# EasyEDA Pro project ProProject_Electonic_keyboard_2023-12-26.epro

# Schematic Electonic Keyboard
Create Date: 2023-12-26; Page Name: P1.Electonic Keyboard; Project Name: Electonic_keyboard; Schematic Name: Electonic Keyboard; Update Date: 2023-12-26; Company: 嘉立创EDA; Drawed: Cameron Bright; Page Size: A4; Reviewed: Cameron Bright; Version: V1.0
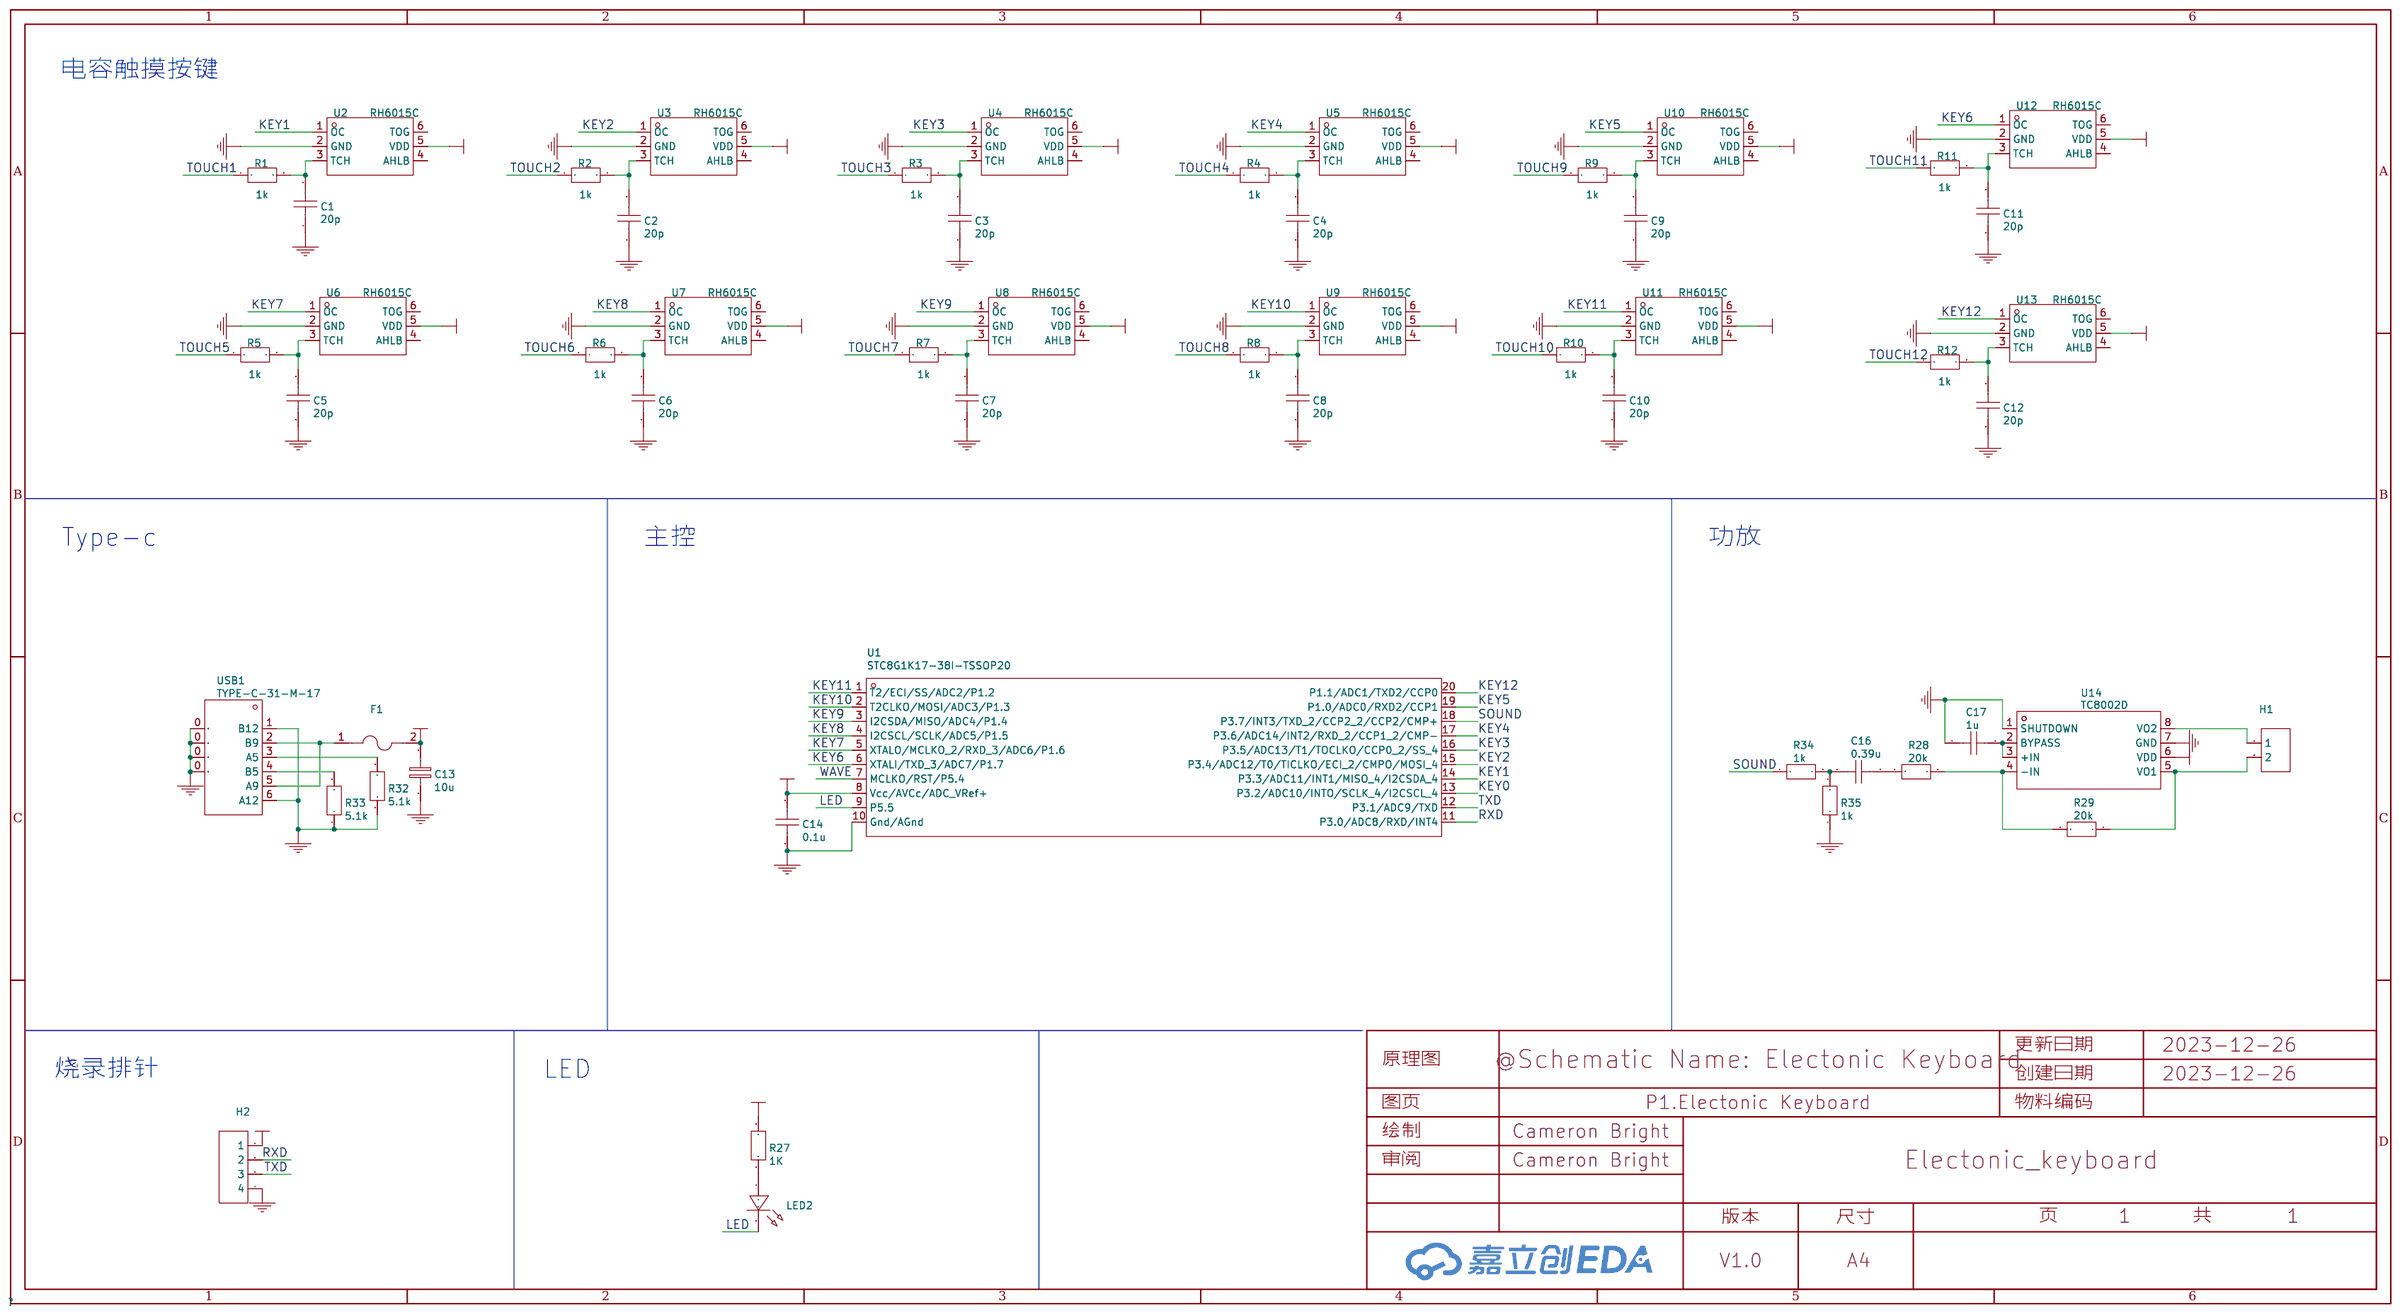
[diagram p0: schematic sheet]

## Parts
C1  20p
C2  20p
C3  20p
C4  20p
C5  20p
C6  20p
C7  20p
C8  20p
C9  20p
C10  20p
C11  20p
C12  20p
C13  10u
C14  0.1u
C16  0.39u
C17  1u
F1  ASMD0805-050
H1  HDR-F-2.54_1x2
H2  HDR-F-2.54_1x4
LED2  LED-0805_R
R1  1k
R2  1k
R3  1k
R4  1k
R5  1k
R6  1k
R7  1k
R8  1k
R9  1k
R10  1k
R11  1k
R12  1k
R27  1K
R28  20k
R29  20k
R32  5.1k
R33  5.1k
R34  1k
R35  1k
U1  STC8G1K17-38I-TSSOP20
U2  RH6015C
U3  RH6015C
U4  RH6015C
U5  RH6015C
U6  RH6015C
U7  RH6015C
U8  RH6015C
U9  RH6015C
U10  RH6015C
U11  RH6015C
U12  RH6015C
U13  RH6015C
U14  TC8002D
USB1  TYPE-C-31-M-17

## Library data of the parts
C1-C12 = 20p
C13 = 10u
C14 = 0.1u
C16 = 0.39u
C17 = 1u
F1 = ASMD0805-050: Supplier: LCSC; Manufacturer: JDTFUSE; Supplier Part: C135329; JLCPCB Part Class: Extended Part
H1 = HDR-F-2.54_1x2: Supplier Part: C49661; Supplier: LCSC
H2 = HDR-F-2.54_1x4: Supplier Part: C225501; Supplier: LCSC
LED2 = LED-0805_R: Manufacturer: EVERLIGHT(台湾亿光); Manufacturer Part: 17-21SURC/S530-A3/TR8; Supplier Part: C72037
R1-R12 R34 R35 = 1k
R27 = 1K
R28 R29 = 20k
R32 R33 = 5.1k
U1 = STC8G1K17-38I-TSSOP20: Supplier: LCSC; Supplier Part: C521759; Manufacturer: STC Micro; JLCPCB Part Class: Extended Part
U2-U13 = RH6015C: Supplier: LCSC; Supplier Part: C161821; Manufacturer: RONGHE Microelectronics; JLCPCB Part Class: Extend
U14 = TC8002D: Supplier: LCSC; Manufacturer: FM(富满); Supplier Part: C87265; JLCPCB Part Class: Extended Part
USB1 = TYPE-C-31-M-17: Supplier: LCSC; Supplier Part: C283540; Manufacturer: Korean Hroparts Elec; JLCPCB Part Class: Extended Part

## Nets
GND: C1.1 C2.1 C3.1 C4.1 C5.1 C6.1 C7.1 C8.1 C9.1 C10.1 C11.1 C12.1 C13.1 C14.1 C17.2 H2.4 R32.1 R33.1 R35.1 U1.10(Gnd/AGnd) U2.2(GND) U3.2(GND) U4.2(GND) U5.2(GND) U6.2(GND) U7.2(GND) U8.2(GND) U9.2(GND) U10.2(GND) U11.2(GND) U12.2(GND) U13.2(GND) U14.1(SHUTDOWN) U14.7(GND) USB1.0 USB1.1(B12) USB1.6(A12)
VCC: C13.2 C14.2 F1.2 H2.1 R27.2 U1.8(Vcc/AVCc/ADC_VRef+) U2.5(VDD) U3.5(VDD) U4.5(VDD) U5.5(VDD) U6.5(VDD) U7.5(VDD) U8.5(VDD) U9.5(VDD) U10.5(VDD) U11.5(VDD) U12.5(VDD) U13.5(VDD) U14.6(VDD)
KEY0: U1.13(P3.2/ADC10/INTO/SCLK_4/I2CSCL_4)
KEY1: U1.14(P3.3/ADC11/INT1/MISO_4/I2CSDA_4) U2.1(OC)
KEY2: U1.15(P3.4/ADC12/T0/TICLKO/ECI_2/CMPO/MOSI_4) U3.1(OC)
KEY3: U1.16(P3.5/ADC13/T1/TOCLKO/CCP0_2/SS_4) U4.1(OC)
KEY4: U1.17(P3.6/ADC14/INT2/RXD_2/CCP1_2/CMP-) U5.1(OC)
KEY5: U1.19(P1.0/ADC0/RXD2/CCP1) U10.1(OC)
KEY6: U1.6(XTALI/TXD_3/ADC7/P1.7) U12.1(OC)
KEY7: U1.5(XTALO/MCLKO_2/RXD_3/ADC6/P1.6) U6.1(OC)
KEY8: U1.4(I2CSCL/SCLK/ADC5/P1.5) U7.1(OC)
KEY9: U1.3(I2CSDA/MISO/ADC4/P1.4) U8.1(OC)
KEY10: U1.2(T2CLKO/MOSI/ADC3/P1.3) U9.1(OC)
KEY11: U1.1(T2/ECI/SS/ADC2/P1.2) U11.1(OC)
KEY12: U1.20(P1.1/ADC1/TXD2/CCP0) U13.1(OC)
LED: LED2.2 U1.9(P5.5)
RXD: H2.2 U1.11(P3.0/ADC8/RXD/INT4)
SOUND: R34.1 U1.18(P3.7/INT3/TXD_2/CCP2_2/CCP2/CMP+)
TOUCH1: R1.1
TOUCH2: R2.1
TOUCH3: R3.1
TOUCH4: R4.1
TOUCH5: R5.1
TOUCH6: R6.1
TOUCH7: R7.1
TOUCH8: R8.1
TOUCH9: R9.1
TOUCH10: R10.1
TOUCH11: R11.1
TOUCH12: R12.1
TXD: H2.3 U1.12(P3.1/ADC9/TXD)
WAVE: U1.7(MCLKO/RST/P5.4)
Net-(C1-2): C1.2 R1.2 U2.3(TCH)
Net-(C2-2): C2.2 R2.2 U3.3(TCH)
Net-(C3-2): C3.2 R3.2 U4.3(TCH)
Net-(C4-2): C4.2 R4.2 U5.3(TCH)
Net-(C5-2): C5.2 R5.2 U6.3(TCH)
Net-(C6-2): C6.2 R6.2 U7.3(TCH)
Net-(C7-2): C7.2 R7.2 U8.3(TCH)
Net-(C8-2): C8.2 R8.2 U9.3(TCH)
Net-(C9-2): C9.2 R9.2 U10.3(TCH)
Net-(C10-2): C10.2 R10.2 U11.3(TCH)
Net-(C11-2): C11.2 R11.2 U12.3(TCH)
Net-(C12-2): C12.2 R12.2 U13.3(TCH)
Net-(C16-1): C16.1 R34.2 R35.2
Net-(C16-2): C16.2 R28.2
Net-(C17-1): C17.1 U14.2(BYPASS) U14.3(+IN)
Net-(F1-1): F1.1 USB1.2(B9) USB1.5(A9)
Net-(H1-1): H1.1 U14.8(VO2)
Net-(H1-2): H1.2 R29.1 U14.5(VO1)
Net-(LED2-1): LED2.1 R27.1
Net-(R28-1): R28.1 R29.2 U14.4(-IN)
Net-(R32-2): R32.2 USB1.3(A5)
Net-(R33-2): R33.2 USB1.4(B5)

Not connected (* = marked no-connect by the designer): U2 4(AHLB) 6(TOG); U3 4(AHLB) 6(TOG); U4 4(AHLB) 6(TOG); U5 4(AHLB) 6(TOG); U6 4(AHLB) 6(TOG); U7 4(AHLB) 6(TOG); U8 4(AHLB) 6(TOG); U9 4(AHLB) 6(TOG); U10 4(AHLB) 6(TOG); U11 4(AHLB) 6(TOG); U12 4(AHLB) 6(TOG); U13 4(AHLB) 6(TOG)

## Notes on the sheet
- 电容触摸按键
- Type-c
- 主控
- 功放
- 烧录排针
- LED

# Schematic 迷你电子琴
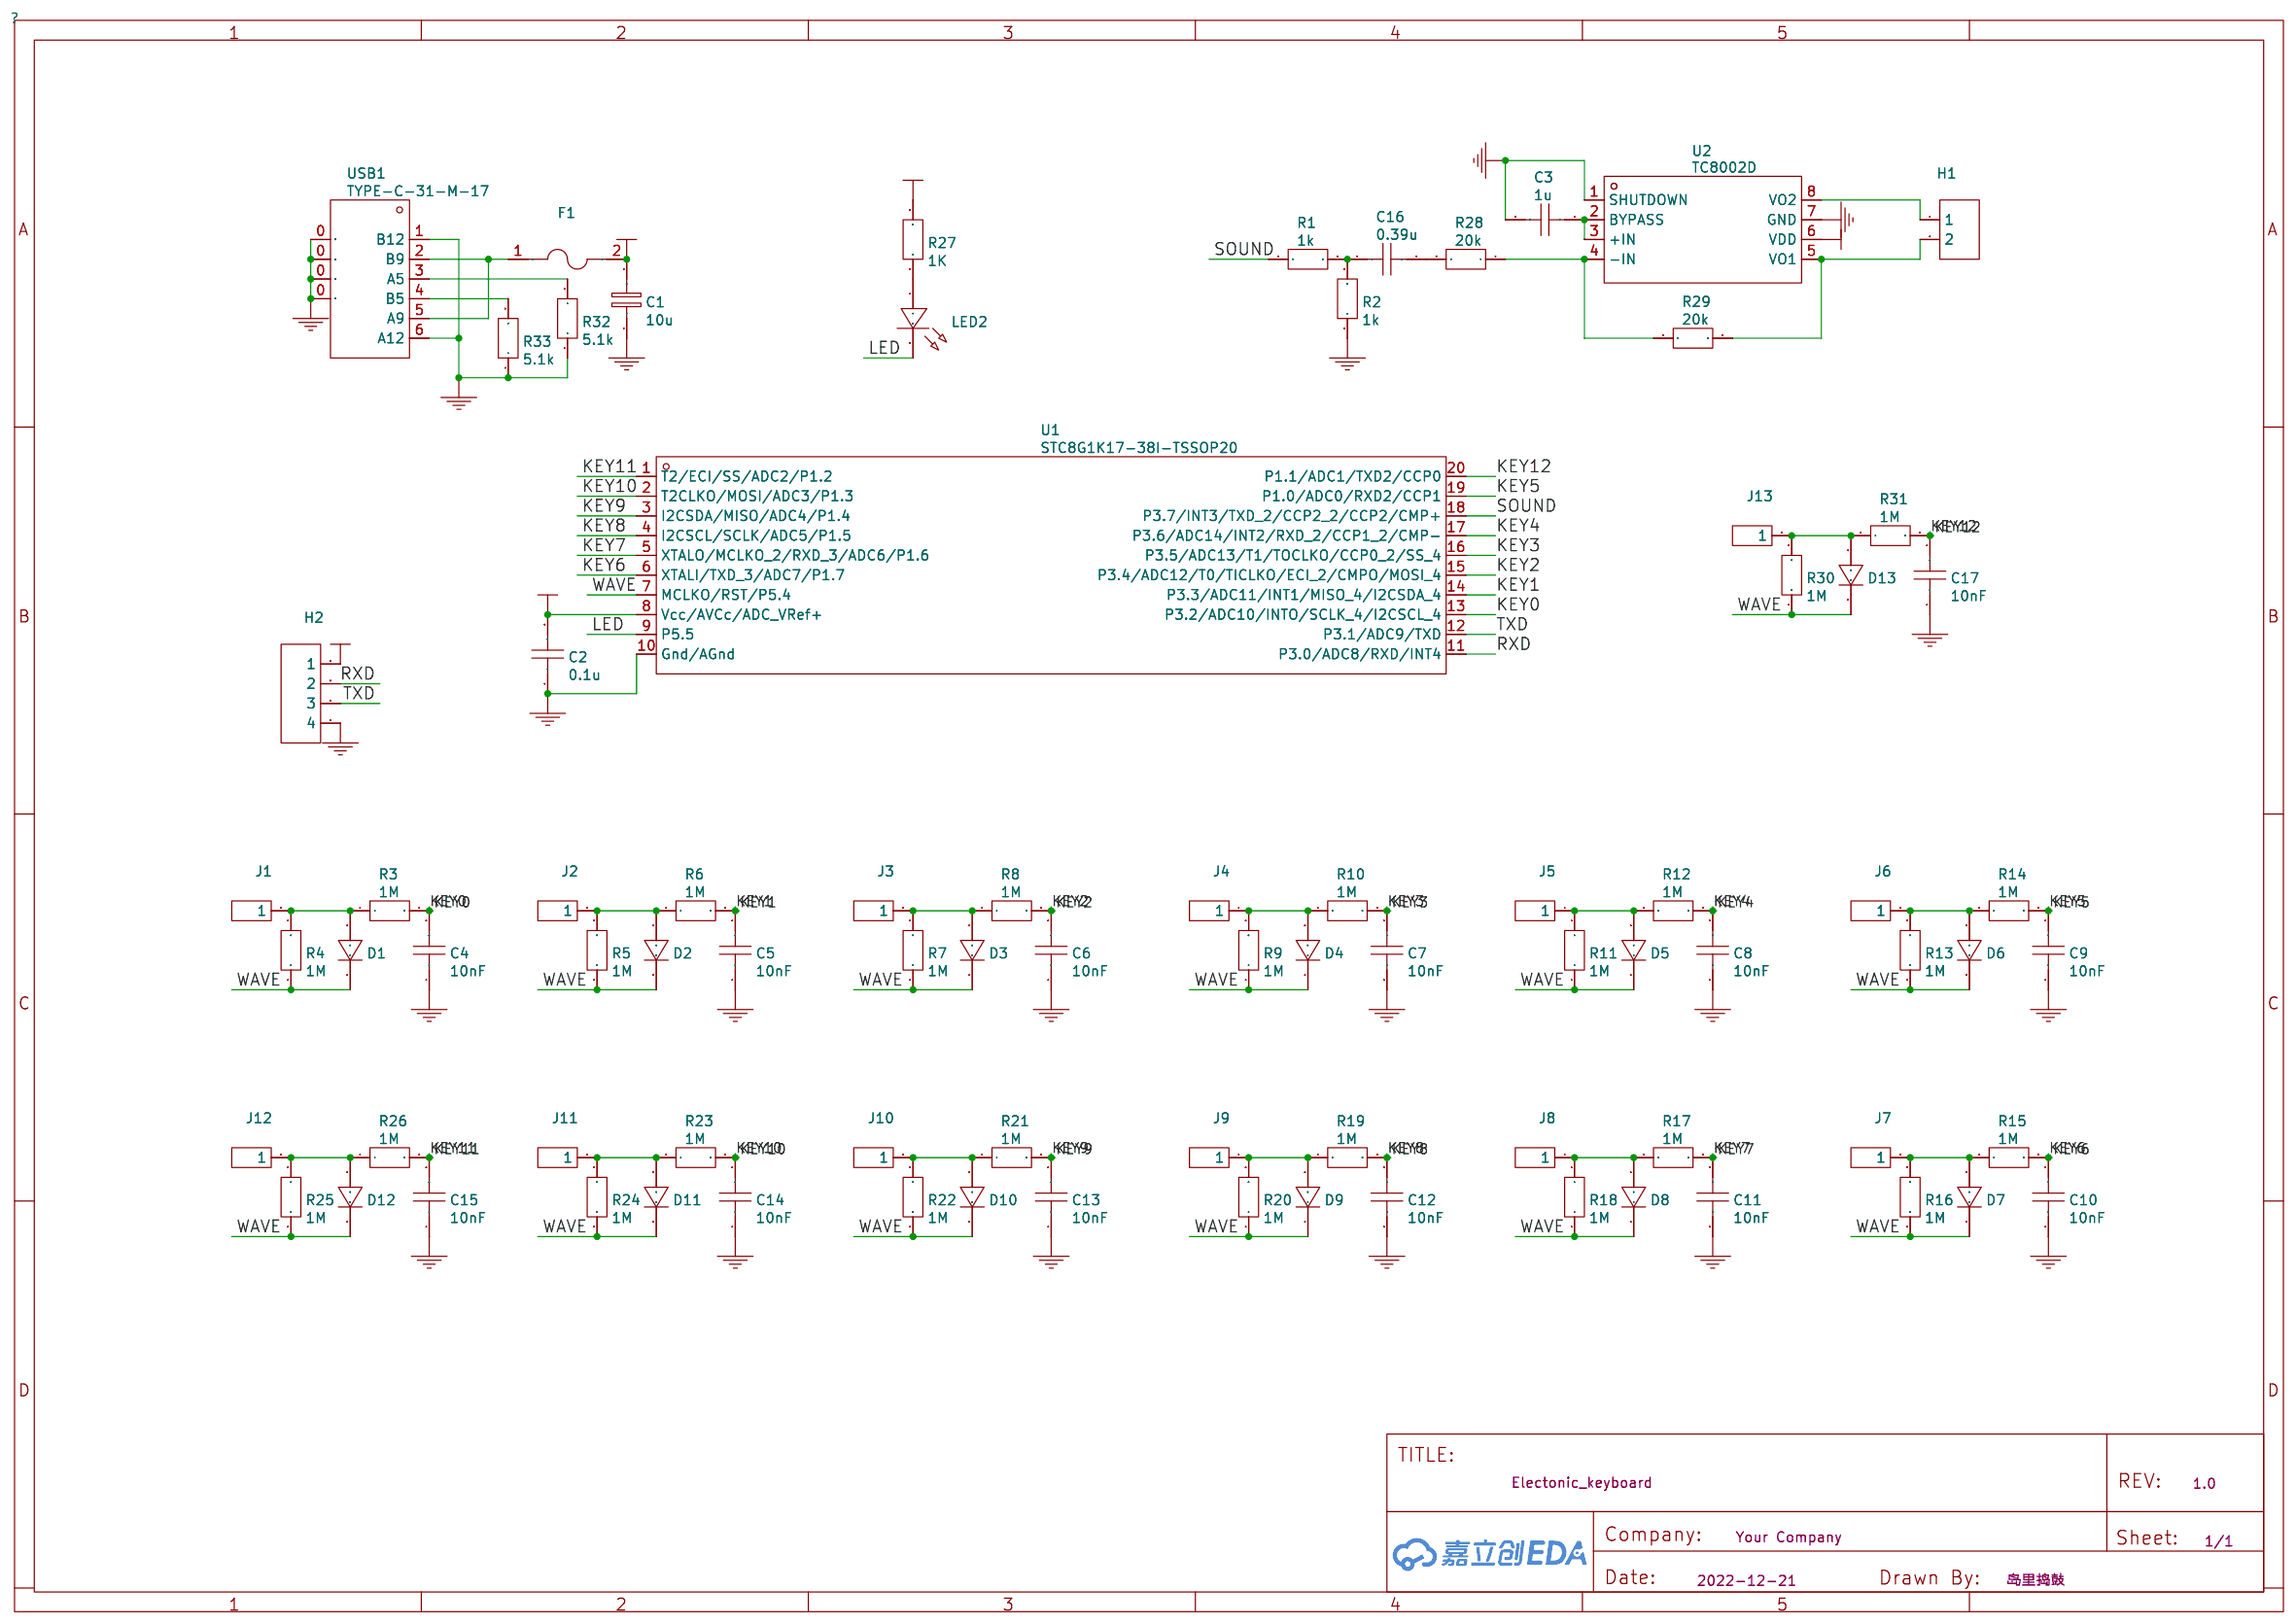
[diagram p1: schematic sheet]

## Parts
C1  10u
C2  0.1u
C3  1u
C4  10nF
C5  10nF
C6  10nF
C7  10nF
C8  10nF
C9  10nF
C10  10nF
C11  10nF
C12  10nF
C13  10nF
C14  10nF
C15  10nF
C16  0.39u
C17  10nF
D1  1N4148W
D2  1N4148W
D3  1N4148W
D4  1N4148W
D5  1N4148W
D6  1N4148W
D7  1N4148W
D8  1N4148W
D9  1N4148W
D10  1N4148W
D11  1N4148W
D12  1N4148W
D13  1N4148W
F1  ASMD0805-050
H1  HDR-F-2.54_1x2
H2  HDR-F-2.54_1x4
J1  HDR-M-2.54_1x1
J2  HDR-M-2.54_1x1
J3  HDR-M-2.54_1x1
J4  HDR-M-2.54_1x1
J5  HDR-M-2.54_1x1
J6  HDR-M-2.54_1x1
J7  HDR-M-2.54_1x1
J8  HDR-M-2.54_1x1
J9  HDR-M-2.54_1x1
J10  HDR-M-2.54_1x1
J11  HDR-M-2.54_1x1
J12  HDR-M-2.54_1x1
J13  HDR-M-2.54_1x1
LED2  LED-0805_R
R1  1k
R2  1k
R3  1M
R4  1M
R5  1M
R6  1M
R7  1M
R8  1M
R9  1M
R10  1M
R11  1M
R12  1M
R13  1M
R14  1M
R15  1M
R16  1M
R17  1M
R18  1M
R19  1M
R20  1M
R21  1M
R22  1M
R23  1M
R24  1M
R25  1M
R26  1M
R27  1K
R28  20k
R29  20k
R30  1M
R31  1M
R32  5.1k
R33  5.1k
U1  STC8G1K17-38I-TSSOP20
U2  TC8002D
USB1  TYPE-C-31-M-17

## Library data of the parts
C1 = 10u
C2 = 0.1u
C3 = 1u
C4-C15 C17 = 10nF
C16 = 0.39u
D1-D13 = 1N4148W: Supplier: LCSC; Manufacturer: Tak Cheong; Supplier Part: C129216
F1 = ASMD0805-050: Supplier: LCSC; Manufacturer: JDTFUSE; Supplier Part: C135329; JLCPCB Part Class: Extended Part
H1 = HDR-F-2.54_1x2: Supplier Part: C49661; Supplier: LCSC
H2 = HDR-F-2.54_1x4: Supplier Part: C225501; Supplier: LCSC
J1-J13 = HDR-M-2.54_1x1: Supplier Part: C81276; Supplier: LCSC
LED2 = LED-0805_R: Manufacturer: EVERLIGHT(台湾亿光); Manufacturer Part: 17-21SURC/S530-A3/TR8; Supplier Part: C72037
R1 R2 = 1k
R3-R26 R30 R31 = 1M
R27 = 1K
R28 R29 = 20k
R32 R33 = 5.1k
U1 = STC8G1K17-38I-TSSOP20: Supplier: LCSC; Supplier Part: C521759; Manufacturer: STC Micro; JLCPCB Part Class: Extended Part
U2 = TC8002D: Supplier: LCSC; Manufacturer: FM(富满); Supplier Part: C87265; JLCPCB Part Class: Extended Part
USB1 = TYPE-C-31-M-17: Supplier: LCSC; Supplier Part: C283540; Manufacturer: Korean Hroparts Elec; JLCPCB Part Class: Extended Part

## Nets
GND: C1.1 C2.1 C3.2 C4.1 C5.1 C6.1 C7.1 C8.1 C9.1 C10.1 C11.1 C12.1 C13.1 C14.1 C15.1 C17.1 H2.4 R2.1 R32.1 R33.1 U1.10(Gnd/AGnd) U2.1(SHUTDOWN) U2.7(GND) USB1.0 USB1.1(B12) USB1.6(A12)
VCC: C1.2 C2.2 F1.2 H2.1 R27.2 U1.8(Vcc/AVCc/ADC_VRef+) U2.6(VDD)
KEY0: C4.2 R3.2 U1.13(P3.2/ADC10/INTO/SCLK_4/I2CSCL_4)
KEY1: C5.2 R6.2 U1.14(P3.3/ADC11/INT1/MISO_4/I2CSDA_4)
KEY2: C6.2 R8.2 U1.15(P3.4/ADC12/T0/TICLKO/ECI_2/CMPO/MOSI_4)
KEY3: C7.2 R10.2 U1.16(P3.5/ADC13/T1/TOCLKO/CCP0_2/SS_4)
KEY4: C8.2 R12.2 U1.17(P3.6/ADC14/INT2/RXD_2/CCP1_2/CMP-)
KEY5: C9.2 R14.2 U1.19(P1.0/ADC0/RXD2/CCP1)
KEY6: C10.2 R15.2 U1.6(XTALI/TXD_3/ADC7/P1.7)
KEY7: C11.2 R17.2 U1.5(XTALO/MCLKO_2/RXD_3/ADC6/P1.6)
KEY8: C12.2 R19.2 U1.4(I2CSCL/SCLK/ADC5/P1.5)
KEY9: C13.2 R21.2 U1.3(I2CSDA/MISO/ADC4/P1.4)
KEY10: C14.2 R23.2 U1.2(T2CLKO/MOSI/ADC3/P1.3)
KEY11: C15.2 R26.2 U1.1(T2/ECI/SS/ADC2/P1.2)
KEY12: C17.2 R31.2 U1.20(P1.1/ADC1/TXD2/CCP0)
LED: LED2.2 U1.9(P5.5)
RXD: H2.2 U1.11(P3.0/ADC8/RXD/INT4)
SOUND: R1.1 U1.18(P3.7/INT3/TXD_2/CCP2_2/CCP2/CMP+)
TXD: H2.3 U1.12(P3.1/ADC9/TXD)
WAVE: D1.1 D2.1 D3.1 D4.1 D5.1 D6.1 D7.1 D8.1 D9.1 D10.1 D11.1 D12.1 D13.1 R4.1 R5.1 R7.1 R9.1 R11.1 R13.1 R16.1 R18.1 R20.1 R22.1 R24.1 R25.1 R30.1 U1.7(MCLKO/RST/P5.4)
Net-(C3-1): C3.1 U2.2(BYPASS) U2.3(+IN)
Net-(C16-1): C16.1 R1.2 R2.2
Net-(C16-2): C16.2 R28.2
Net-(D1-2): D1.2 J1.1 R3.1 R4.2
Net-(D2-2): D2.2 J2.1 R5.2 R6.1
Net-(D3-2): D3.2 J3.1 R7.2 R8.1
Net-(D4-2): D4.2 J4.1 R9.2 R10.1
Net-(D5-2): D5.2 J5.1 R11.2 R12.1
Net-(D6-2): D6.2 J6.1 R13.2 R14.1
Net-(D7-2): D7.2 J7.1 R15.1 R16.2
Net-(D8-2): D8.2 J8.1 R17.1 R18.2
Net-(D9-2): D9.2 J9.1 R19.1 R20.2
Net-(D10-2): D10.2 J10.1 R21.1 R22.2
Net-(D11-2): D11.2 J11.1 R23.1 R24.2
Net-(D12-2): D12.2 J12.1 R25.2 R26.1
Net-(D13-2): D13.2 J13.1 R30.2 R31.1
Net-(F1-1): F1.1 USB1.2(B9) USB1.5(A9)
Net-(H1-1): H1.1 U2.8(VO2)
Net-(H1-2): H1.2 R29.1 U2.5(VO1)
Net-(LED2-1): LED2.1 R27.1
Net-(R28-1): R28.1 R29.2 U2.4(-IN)
Net-(R32-2): R32.2 USB1.3(A5)
Net-(R33-2): R33.2 USB1.4(B5)

# Schematic Mini_Piano
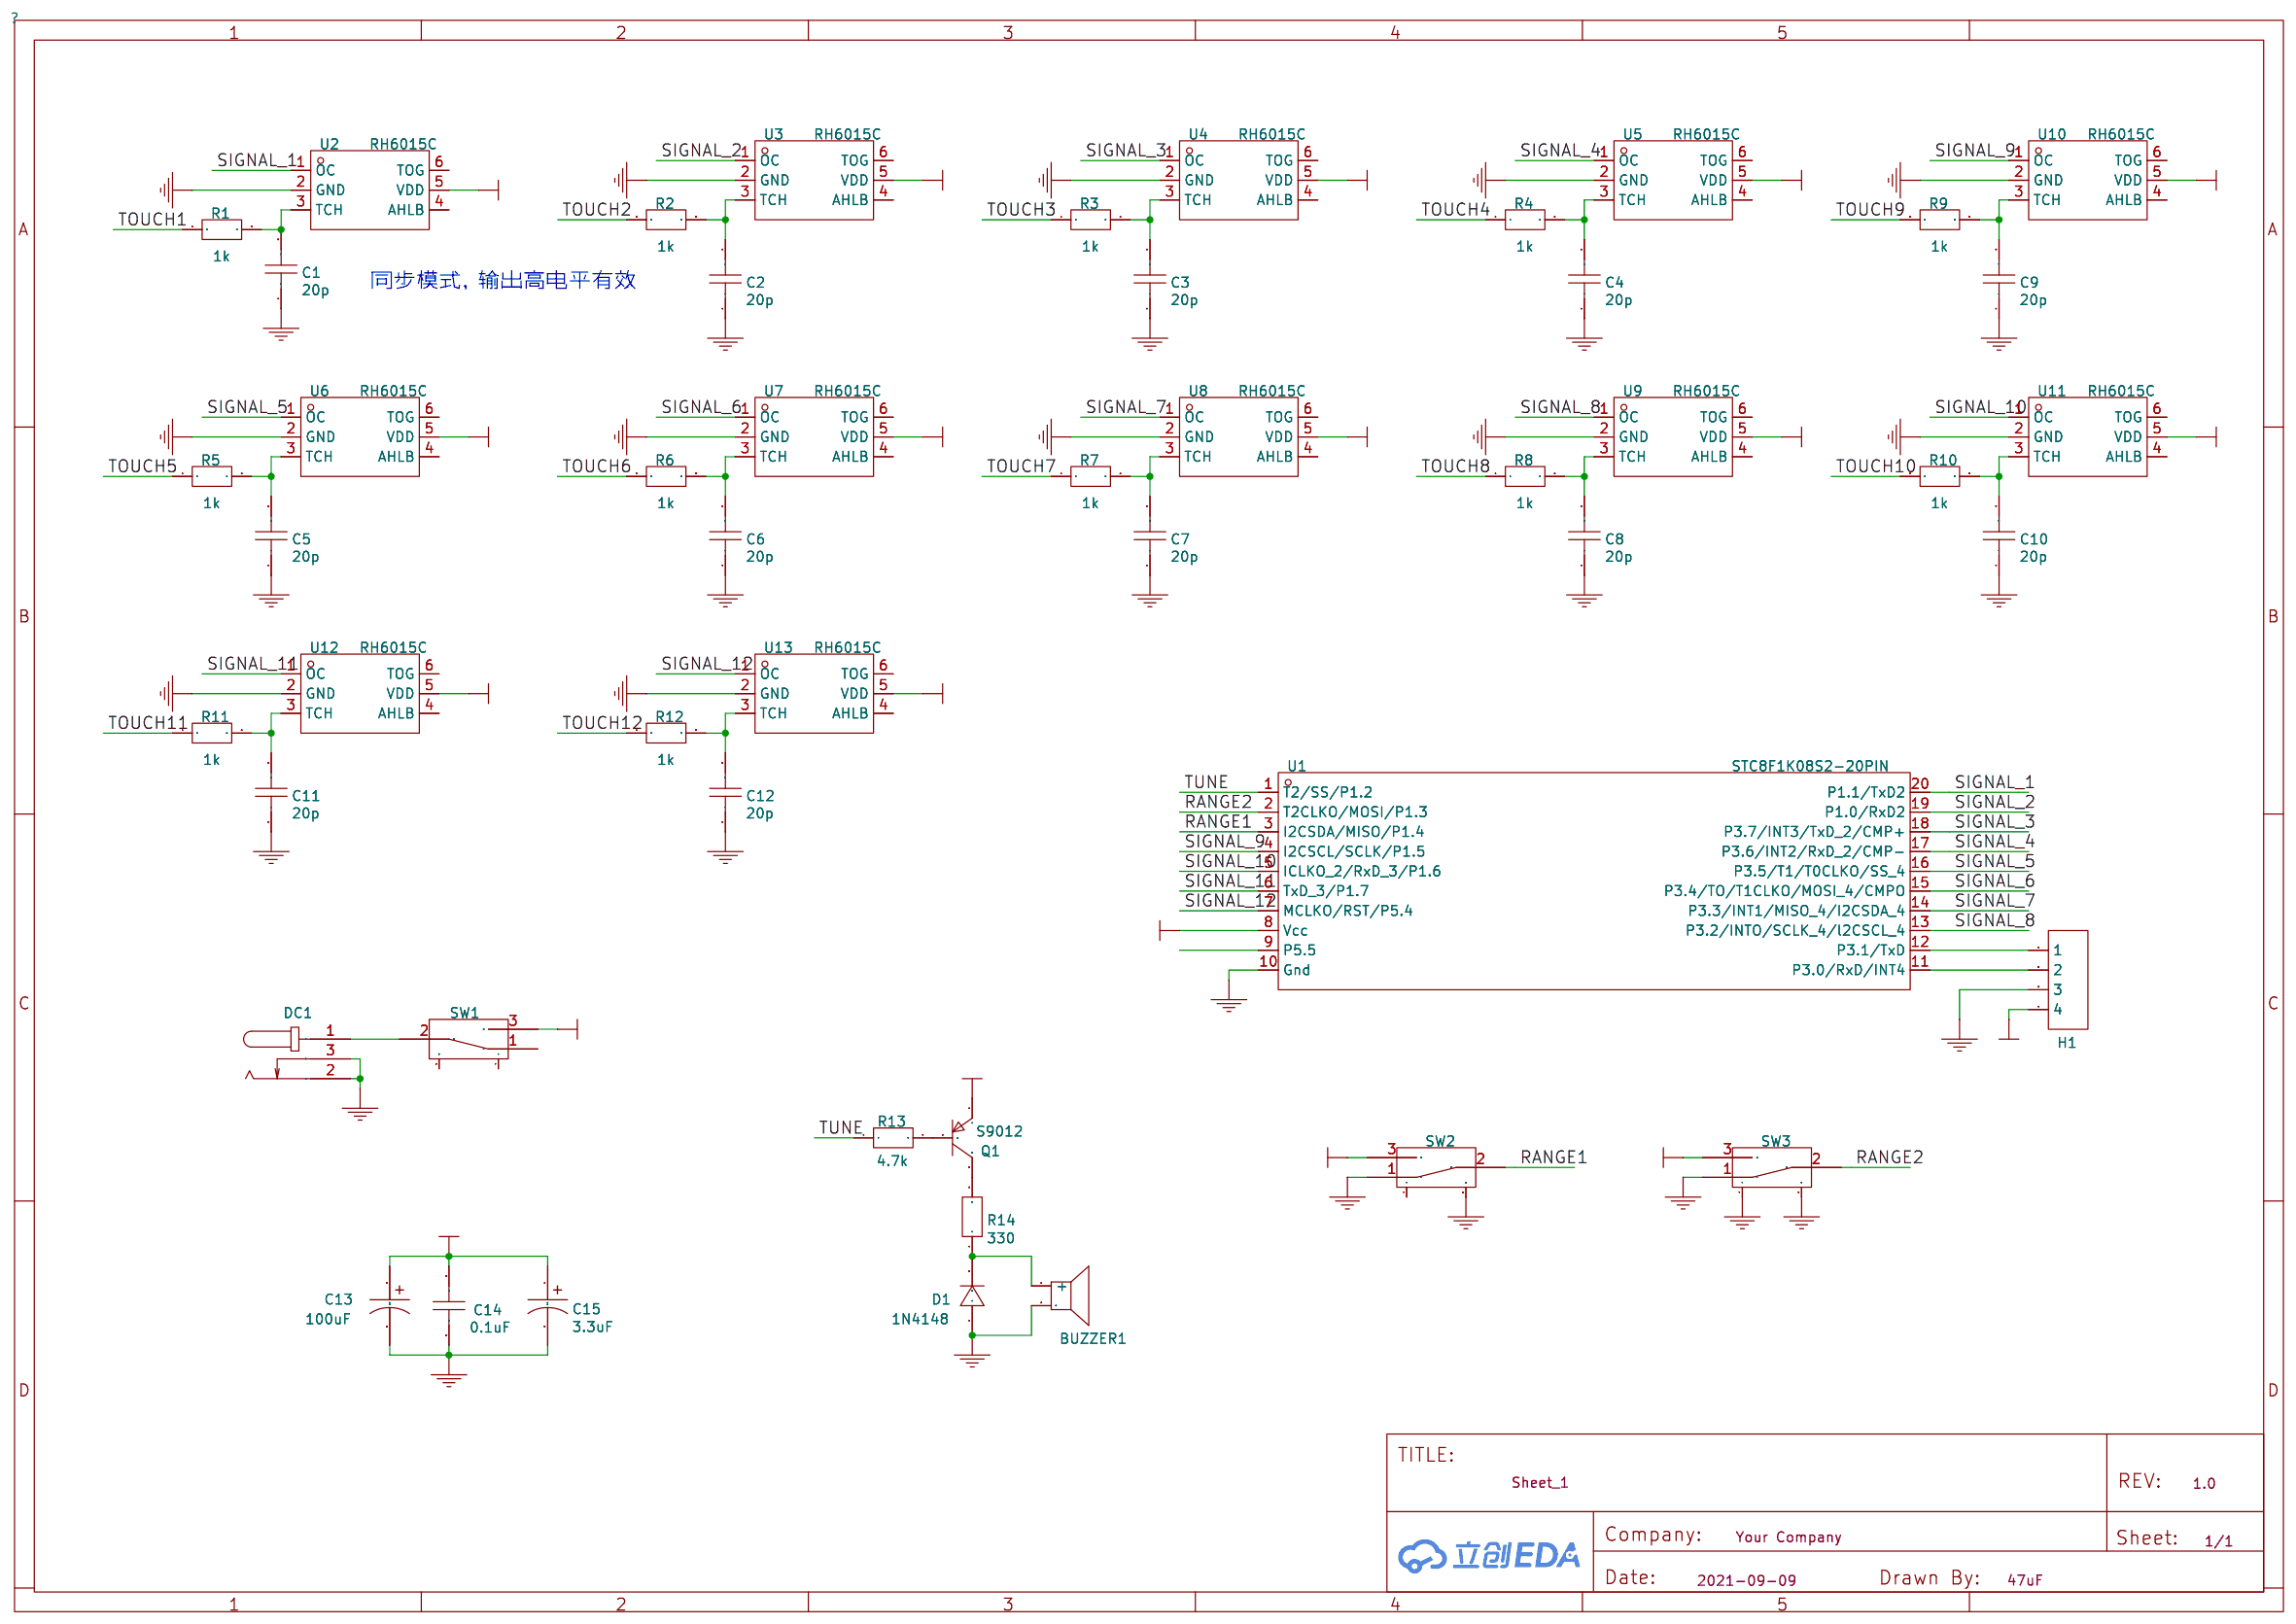
[diagram p2: schematic sheet]

## Parts
BUZZER1  SUN-12095-5VPA7.6
C1  20p
C2  20p
C3  20p
C4  20p
C5  20p
C6  20p
C7  20p
C8  20p
C9  20p
C10  20p
C11  20p
C12  20p
C13  100uF
C14  0.1uF
C15  3.3uF
D1  1N4148
DC1  DC005-T
H1  HDR-F-2.54_1x4
Q1  S9012
R1  1k
R2  1k
R3  1k
R4  1k
R5  1k
R6  1k
R7  1k
R8  1k
R9  1k
R10  1k
R11  1k
R12  1k
R13  4.7k
R14  330
SW1  SK-12D02-VG5
SW2  SK-12D02-VG5
SW3  SK-12D02-VG5
U1  STC8F1K08S2-20PIN
U2  RH6015C
U3  RH6015C
U4  RH6015C
U5  RH6015C
U6  RH6015C
U7  RH6015C
U8  RH6015C
U9  RH6015C
U10  RH6015C
U11  RH6015C
U12  RH6015C
U13  RH6015C

## Library data of the parts
BUZZER1 = SUN-12095-5VPA7.6: Supplier: LCSC; Supplier Part: C360615; Manufacturer: S&amp;S; JLCPCB Part Class: Extended Part
C1-C12 = 20p
C13 = 100uF
C14 = 0.1uF
C15 = 3.3uF
D1 = 1N4148: Supplier: LCSC; Manufacturer: SEMTECH; Supplier Part: C14516
DC1 = DC005-T: Supplier: LCSC; Supplier Part: C431532; Manufacturer: SHOU HAN; JLCPCB Part Class: Extended Part
H1 = HDR-F-2.54_1x4: Supplier Part: C225501; Supplier: LCSC
Q1 = S9012: Supplier: LCSC; Manufacturer: KEC; Manufacturer Part: 2N3906S-RTK/PS; Supplier Part: C147294
R1-R12 = 1k
R13 = 4.7k
R14 = 330
SW1-SW3 = SK-12D02-VG5: Supplier: LCSC; Supplier Part: C136722; Manufacturer: Rectangular Connectors - Contacts
U1 = STC8F1K08S2-20PIN: Supplier: LCSC; Supplier Part: C2835636; Manufacturer: null; Manufacturer Part: STC8F1K08S2-20pin; JLCPCB Part Class: Extended Part
U2-U13 = RH6015C: Supplier: LCSC; Supplier Part: C161821; Manufacturer: RONGHE Microelectronics; JLCPCB Part Class: Extend

## Nets
GND: BUZZER1.2 C1.1 C2.1 C3.1 C4.1 C5.1 C6.1 C7.1 C8.1 C9.1 C10.1 C11.1 C12.1 C13.2 C14.1 C15.2 D1.1 DC1.2 DC1.3 H1.3 SW2.1 SW2.5 SW3.1 SW3.4 SW3.5 U1.10(Gnd) U2.2(GND) U3.2(GND) U4.2(GND) U5.2(GND) U6.2(GND) U7.2(GND) U8.2(GND) U9.2(GND) U10.2(GND) U11.2(GND) U12.2(GND) U13.2(GND)
VCC: C13.1 C14.2 C15.1 H1.4 Q1.1(E) SW1.3 SW2.3 SW3.3 U1.8(Vcc) U2.5(VDD) U3.5(VDD) U4.5(VDD) U5.5(VDD) U6.5(VDD) U7.5(VDD) U8.5(VDD) U9.5(VDD) U10.5(VDD) U11.5(VDD) U12.5(VDD) U13.5(VDD)
RANGE1: SW2.2 U1.3(I2CSDA/MISO/P1.4)
RANGE2: SW3.2 U1.2(T2CLKO/MOSI/P1.3)
SIGNAL_1: U1.20(P1.1/TxD2) U2.1(OC)
SIGNAL_2: U1.19(P1.0/RxD2) U3.1(OC)
SIGNAL_3: U1.18(P3.7/INT3/TxD_2/CMP+) U4.1(OC)
SIGNAL_4: U1.17(P3.6/INT2/RxD_2/CMP-) U5.1(OC)
SIGNAL_5: U1.16(P3.5/T1/T0CLKO/SS_4) U6.1(OC)
SIGNAL_6: U1.15(P3.4/TO/T1CLKO/MOSI_4/CMPO) U7.1(OC)
SIGNAL_7: U1.14(P3.3/INT1/MISO_4/I2CSDA_4) U8.1(OC)
SIGNAL_8: U1.13(P3.2/INTO/SCLK_4/l2CSCL_4) U9.1(OC)
SIGNAL_9: U1.4(I2CSCL/SCLK/P1.5) U10.1(OC)
SIGNAL_10: U1.5(ICLKO_2/RxD_3/P1.6) U11.1(OC)
SIGNAL_11: U1.6(TxD_3/P1.7) U12.1(OC)
SIGNAL_12: U1.7(MCLKO/RST/P5.4) U13.1(OC)
TOUCH1: R1.1
TOUCH2: R2.1
TOUCH3: R3.1
TOUCH4: R4.1
TOUCH5: R5.1
TOUCH6: R6.1
TOUCH7: R7.1
TOUCH8: R8.1
TOUCH9: R9.1
TOUCH10: R10.1
TOUCH11: R11.1
TOUCH12: R12.1
TUNE: R13.1 U1.1(T2/SS/P1.2)
Net-(BUZZER1-1): BUZZER1.1(+) D1.2 R14.1
Net-(C1-2): C1.2 R1.2 U2.3(TCH)
Net-(C2-2): C2.2 R2.2 U3.3(TCH)
Net-(C3-2): C3.2 R3.2 U4.3(TCH)
Net-(C4-2): C4.2 R4.2 U5.3(TCH)
Net-(C5-2): C5.2 R5.2 U6.3(TCH)
Net-(C6-2): C6.2 R6.2 U7.3(TCH)
Net-(C7-2): C7.2 R7.2 U8.3(TCH)
Net-(C8-2): C8.2 R8.2 U9.3(TCH)
Net-(C9-2): C9.2 R9.2 U10.3(TCH)
Net-(C10-2): C10.2 R10.2 U11.3(TCH)
Net-(C11-2): C11.2 R11.2 U12.3(TCH)
Net-(C12-2): C12.2 R12.2 U13.3(TCH)
Net-(DC1-1): DC1.1 SW1.2
Net-(H1-1): H1.1 U1.12(P3.1/TxD)
Net-(H1-2): H1.2 U1.11(P3.0/RxD/INT4)
Net-(Q1-2): Q1.2(B) R13.2
Net-(Q1-3): Q1.3(C) R14.2

Not connected (* = marked no-connect by the designer): SW1 1 4 5; SW2 4; U1 9(P5.5); U2 4(AHLB) 6(TOG); U3 4(AHLB) 6(TOG); U4 4(AHLB) 6(TOG); U5 4(AHLB) 6(TOG); U6 4(AHLB) 6(TOG); U7 4(AHLB) 6(TOG); U8 4(AHLB) 6(TOG); U9 4(AHLB) 6(TOG); U10 4(AHLB) 6(TOG); U11 4(AHLB) 6(TOG); U12 4(AHLB) 6(TOG); U13 4(AHLB) 6(TOG)

## Notes on the sheet
- 同步模式，输出高电平有效

# Board PCB_ePiano_2023-12-26
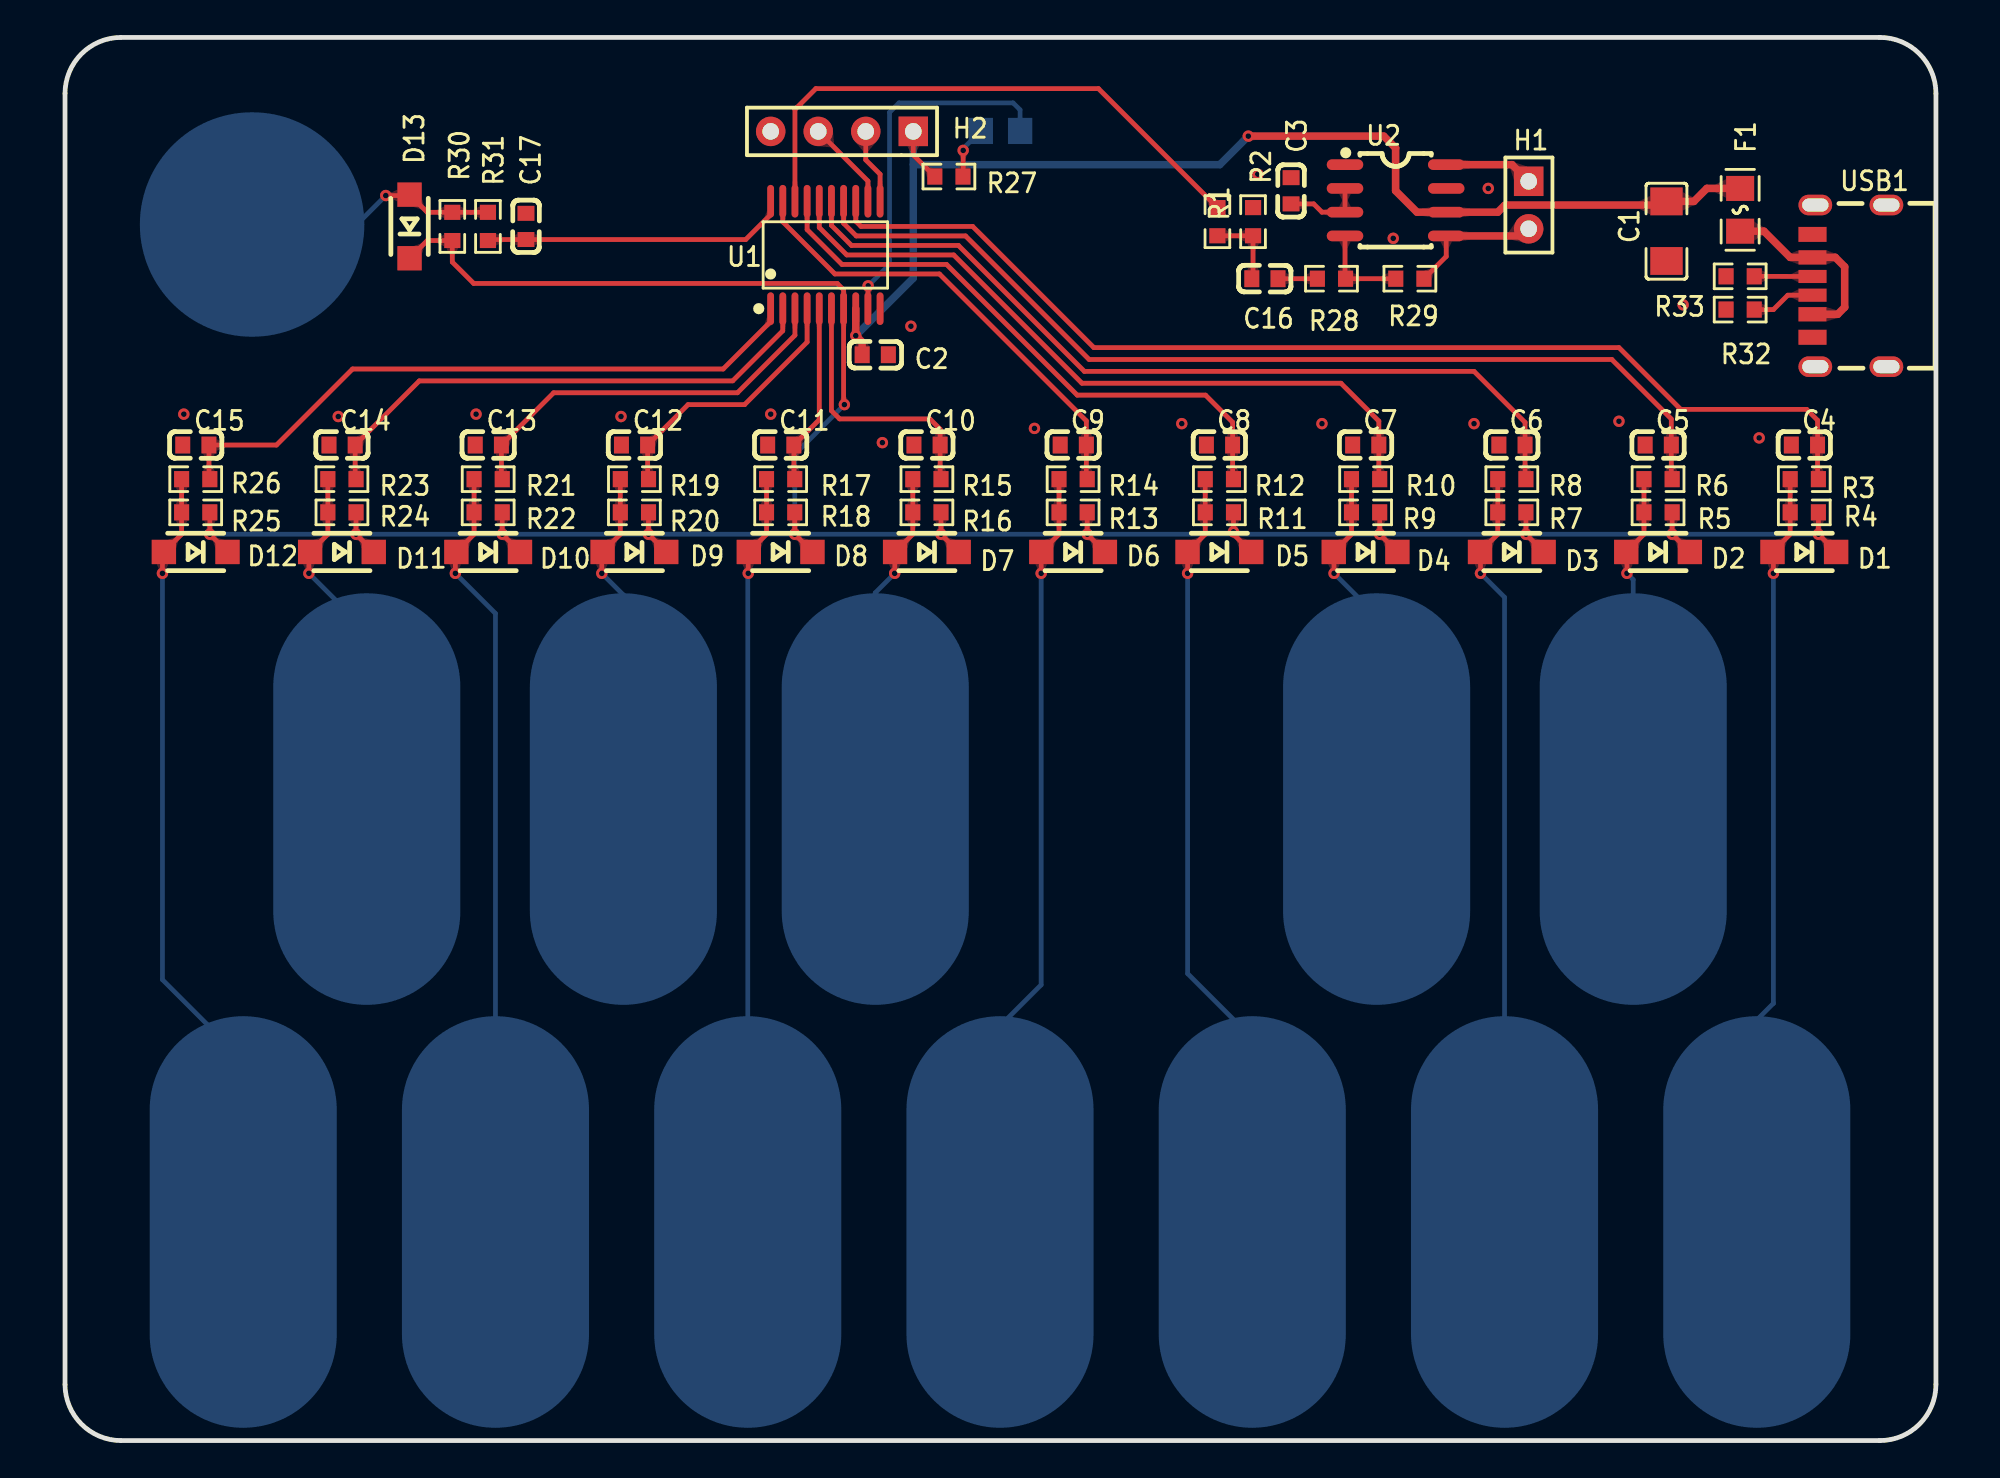
[diagram p3: board, top side]
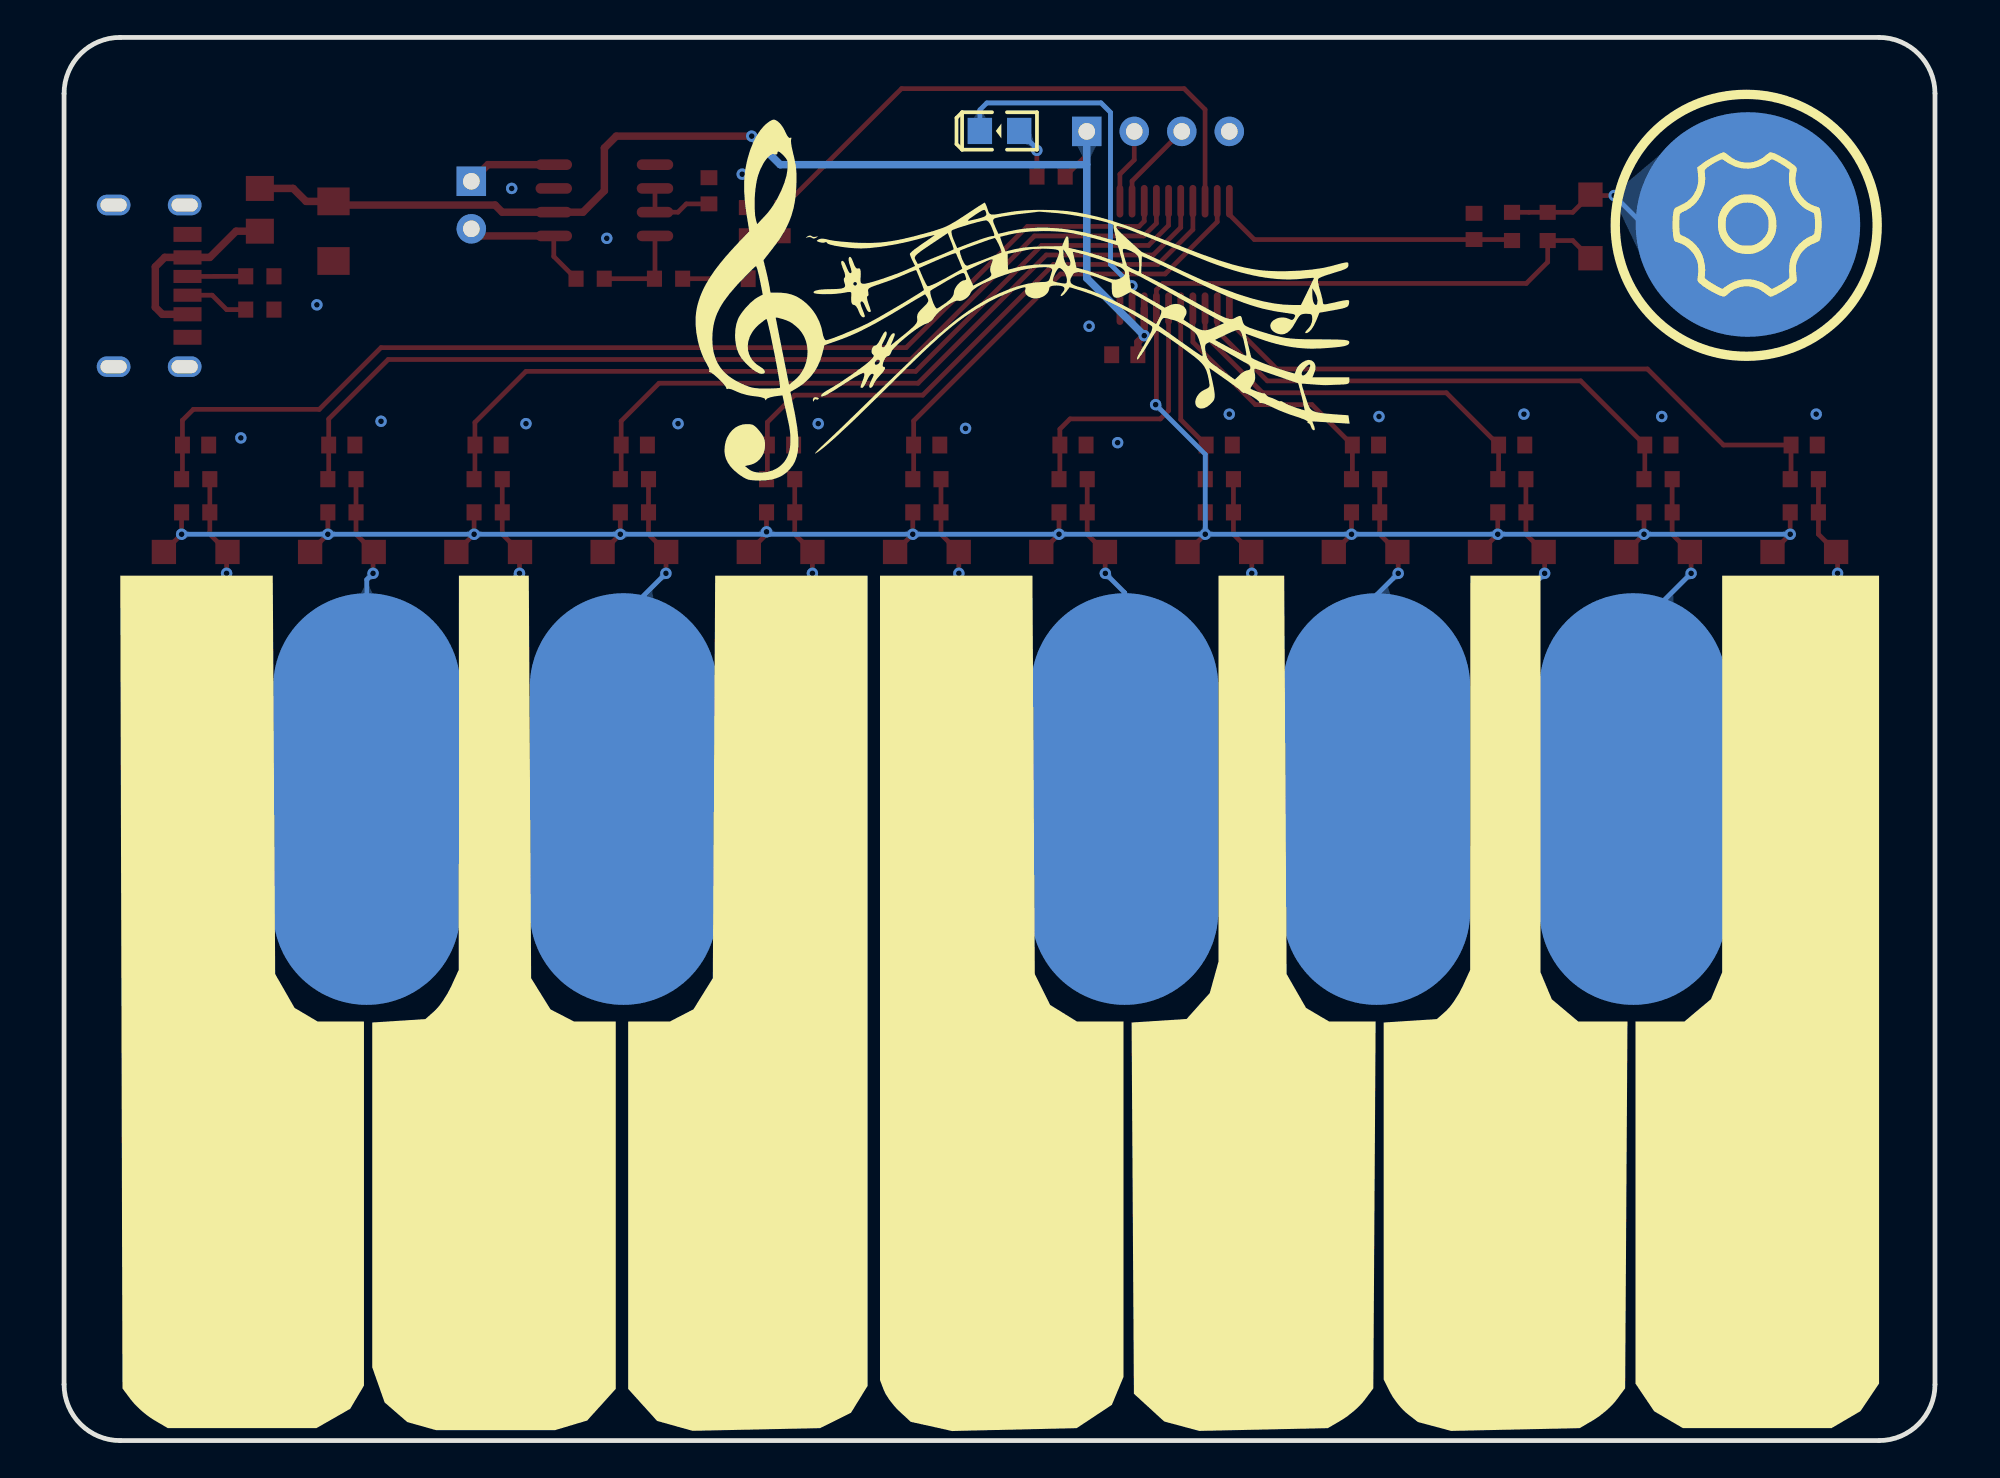
[diagram p4: board, bottom side, seen from below]

Outline 100 x 75 mm; copper layers: Top Layer, Bottom Layer. Coordinates in mm from the lower left corner of the outline.
Outline path: 0,72 arc(0.88,74.12) 3,75 97,75 arc(99.12,74.12) 100,72 100,3 arc(99.12,0.88) 97,0 3,0 arc(0.88,0.88) 0,3 0,72
Stack: Top Layer 0.035mm / Dielectric1 1.51mm FR4 er 4.5 / Bottom Layer 0.035mm

## Design rules (mm)
spacing Default (default): track to track 0.152, other pairs 0 to 0.152
track width Default (default): min 0.254, default 0.254, max 25.4
differential pair differentialPair (default): width min 0.127, default 0.254, max 2.54; gap min 0.152, default 0.152
via Default (default): diameter min 0.61, default 0.61, max 100.025; hole min 0.305, default 0.305, max 59.995
net GND uses gge10596
pour e480 uses gge10476
pour e583 uses gge10596

## Placement (name value [footprint] x y rotation side)
C1  10u  [C1206]  85.6 64.64 90 top
C2  0.1u  [C0603]  43.31 58.04 180 top
C3  1u  [C0603]  65.53 66.8 90 top
C4  10nF  [C0603]  92.97 53.21 0 top
C5  10nF  [C0603]  85.16 53.21 0 top
C6  10nF  [C0603]  77.34 53.21 0 top
C7  10nF  [C0603]  69.52 53.21 0 top
C8  10nF  [C0603]  61.71 53.21 0 top
C9  10nF  [C0603]  53.89 53.21 0 top
C10  10nF  [C0603]  46.07 53.21 0 top
C11  10nF  [C0603]  38.26 53.21 0 top
C12  10nF  [C0603]  30.44 53.21 0 top
C13  10nF  [C0603]  22.62 53.21 0 top
C14  10nF  [C0603]  14.81 53.21 0 top
C15  10nF  [C0603]  6.99 53.21 0 top
C16  0.39u  [C0603]  64.13 62.1 0 top
C17  10nF  [C0603]  24.64 64.9 270 top
D1  1N4148W  [SOD-123FL_L2.6-W1.6-LS3.4-RD]  92.96 47.5 0 top
D2  1N4148W  [SOD-123FL_L2.6-W1.6-LS3.4-RD]  85.15 47.5 0 top
D3  1N4148W  [SOD-123FL_L2.6-W1.6-LS3.4-RD]  77.33 47.5 0 top
D4  1N4148W  [SOD-123FL_L2.6-W1.6-LS3.4-RD]  69.51 47.5 0 top
D5  1N4148W  [SOD-123FL_L2.6-W1.6-LS3.4-RD]  61.7 47.5 0 top
D6  1N4148W  [SOD-123FL_L2.6-W1.6-LS3.4-RD]  53.88 47.5 0 top
D7  1N4148W  [SOD-123FL_L2.6-W1.6-LS3.4-RD]  46.07 47.5 0 top
D8  1N4148W  [SOD-123FL_L2.6-W1.6-LS3.4-RD]  38.25 47.5 0 top
D9  1N4148W  [SOD-123FL_L2.6-W1.6-LS3.4-RD]  30.43 47.5 0 top
D10  1N4148W  [SOD-123FL_L2.6-W1.6-LS3.4-RD]  22.62 47.5 0 top
D11  1N4148W  [SOD-123FL_L2.6-W1.6-LS3.4-RD]  14.8 47.5 0 top
D12  1N4148W  [SOD-123FL_L2.6-W1.6-LS3.4-RD]  6.98 47.5 0 top
D13  1N4148W  [SOD-123FL_L2.6-W1.6-LS3.4-RD]  18.42 64.9 270 top
F1  ASMD0805-050  [F0805]  89.53 65.79 90 top
H1  HDR-F-2.54_1x2  [HDR-F-2.54_1X2]  78.23 66.04 270 top
H2  HDR-F-2.54_1x4  [HDR-F-2.54_1X4]  41.53 69.98 180 top
J1  HDR-M-2.54_1x1  [TOUCH_PAD]  90.42 11.68 180 bottom
J2  HDR-M-2.54_1x1  [TOUCH_PAD]  83.82 34.29 180 bottom
J3  HDR-M-2.54_1x1  [TOUCH_PAD]  76.94 11.68 180 bottom
J4  HDR-M-2.54_1x1  [TOUCH_PAD]  70.1 34.29 180 bottom
J5  HDR-M-2.54_1x1  [TOUCH_PAD]  63.46 11.68 180 bottom
J6  HDR-M-2.54_1x1  [TOUCH_PAD]  49.97 11.68 180 bottom
J7  HDR-M-2.54_1x1  [TOUCH_PAD]  43.31 34.29 180 bottom
J8  HDR-M-2.54_1x1  [TOUCH_PAD]  36.49 11.68 180 bottom
J9  HDR-M-2.54_1x1  [TOUCH_PAD]  29.84 34.29 180 bottom
J10  HDR-M-2.54_1x1  [TOUCH_PAD]  23.01 11.68 180 bottom
J11  HDR-M-2.54_1x1  [TOUCH_PAD]  16.13 34.29 180 bottom
J12  HDR-M-2.54_1x1  [TOUCH_PAD]  9.53 11.68 180 bottom
J13  HDR-M-2.54_1x1  [TOUCH_PAD#2]  10 65 180 bottom
LED2  LED-0805_R  [LED0805_RED]  50 70 0 bottom
R1  1k  [R0603]  61.59 65.15 270 top
R2  1k  [R0603]  63.5 65.15 270 top
R3  1M  [R0603]  92.96 51.39 0 top
R4  1M  [R0603]  92.96 49.61 180 top
R5  1M  [R0603]  85.15 49.61 180 top
R6  1M  [R0603]  85.15 51.39 0 top
R7  1M  [R0603]  77.33 49.61 180 top
R8  1M  [R0603]  77.33 51.39 0 top
R9  1M  [R0603]  69.51 49.61 180 top
R10  1M  [R0603]  69.51 51.39 0 top
R11  1M  [R0603]  61.7 49.61 180 top
R12  1M  [R0603]  61.7 51.39 0 top
R13  1M  [R0603]  53.88 49.61 180 top
R14  1M  [R0603]  53.88 51.39 0 top
R15  1M  [R0603]  46.07 51.39 0 top
R16  1M  [R0603]  46.07 49.61 180 top
R17  1M  [R0603]  38.25 51.39 0 top
R18  1M  [R0603]  38.25 49.61 180 top
R19  1M  [R0603]  30.43 51.39 0 top
R20  1M  [R0603]  30.43 49.61 180 top
R21  1M  [R0603]  22.62 51.39 0 top
R22  1M  [R0603]  22.62 49.61 180 top
R23  1M  [R0603]  14.8 51.39 0 top
R24  1M  [R0603]  14.8 49.61 180 top
R25  1M  [R0603]  6.98 49.61 180 top
R26  1M  [R0603]  6.98 51.39 0 top
R27  1K  [R0603]  47.24 67.56 180 top
R28  20k  [R0603]  67.69 62.1 180 top
R29  20k  [R0603]  71.88 62.1 180 top
R30  1M  [R0603]  20.7 64.9 90 top
R31  1M  [R0603]  22.61 64.9 270 top
R32  5.1k  [R0603]  89.53 60.45 0 top
R33  5.1k  [R0603]  89.53 62.23 0 top
U1  STC8G1K17-38I-TSSOP20  [TSSOP-20_L6.5-W4.4-P0.65-LS6.4-BL]  40.64 63.37 0 top
U2  TC8002D  [SOIC-8_L5.0-W4.0-P1.27-LS6.0-BL]  71.12 66.29 270 top
USB1  TYPE-C-31-M-17  [USB-C-SMD_10P-P1.00-L6.8-W8.9]  95.38 61.72 90 top

## Footprints (pads in the part's own frame, mm; a bottom-side part is the same pattern mirrored in y, then rotated)
C0603
  rect 0.8x0.9 smd: 1(-0.7,0) 2(0.7,0)
C1206
  rect 1.485x1.728 smd: 1(-1.593,0) 2(1.593,0)
F0805
  rect 1.335x1.5 smd: 1(-1.143,0) 2(1.143,0)
HDR-F-2.54_1X2
  rect 1.575x1.575 hole 0.889: 1(-1.27,0)
  round 1.575 hole 0.889: 2(1.27,0)
HDR-F-2.54_1X4
  rect 1.575x1.575 hole 0.889: 1(-3.81,0)
  round 1.575 hole 0.889: 2(-1.27,0) 3(1.27,0) 4(3.81,0)
LED0805_RED
  rect 1.3x1.399 smd: 1(-1.05,0) 2(1.05,0)
R0603
  rect 0.806x0.864 smd: 1(-0.753,0) 2(0.753,0)
SOD-123FL_L2.6-W1.6-LS3.4-RD
  rect 1.3x1.3 smd: 1(1.7,0) 2(-1.7,0)
SOIC-8_L5.0-W4.0-P1.27-LS6.0-BL
  oval 0.569x1.95 smd: 1(-1.905,-2.705) 2(-0.635,-2.705) 3(0.635,-2.705) 4(1.905,-2.705) 5(1.905,2.705) 6(0.635,2.705) 7(-0.635,2.705) 8(-1.905,2.705)
TOUCH_PAD
  oval 10x22 smd: 1(0,0)
TOUCH_PAD#2
  round 12 smd: 1(0,0)
TSSOP-20_L6.5-W4.4-P0.65-LS6.4-BL
  oval 0.364x1.742 smd: 1(-2.925,-2.871) 2(-2.275,-2.871) 3(-1.625,-2.871) 4(-0.975,-2.871) 5(-0.325,-2.871) 6(0.325,-2.871) 7(0.975,-2.871) 8(1.625,-2.871) 9(2.275,-2.871) 10(2.925,-2.871) 11(2.925,2.871) 12(2.275,2.871) 13(1.625,2.871) 14(0.975,2.871) 15(0.325,2.871) 16(-0.325,2.871) 17(-0.975,2.871) 18(-1.625,2.871) 19(-2.275,2.871) 20(-2.925,2.871)
USB-C-SMD_10P-P1.00-L6.8-W8.9
  oval 1.1x1.8 hole 0.7x1.401: 0(4.32,1.825) 7(-4.32,1.825) 8(4.32,-1.975) 9(-4.32,-1.975)
  rect 0.8x1.5 smd: 1(-2.749,1.975) 6(2.749,1.975)
  rect 0.76x1.5 smd: 2(-1.52,1.975) 5(1.52,1.975)
  rect 0.7x1.5 smd: 3(-0.5,1.975) 4(0.5,1.975)

## Nets
GND: C1.1 C2.1 C3.2 C4.1 C5.1 C6.1 C7.1 C8.1 C9.1 C10.1 C11.1 C12.1 C13.1 C14.1 C15.1 C17.1 H2.4 R2.1 R32.1 R33.1 U1.10 U2.1 U2.7 USB1.0 USB1.1 USB1.6 USB1.7 USB1.8 USB1.9
VCC: C1.2 C2.2 F1.2 H2.1 R27.2 U1.8 U2.6
C3_1: C3.1 U2.2 U2.3
F1_1: F1.1 USB1.2 USB1.5
H1_1: H1.1 U2.8
H1_2: H1.2 R29.1 U2.5
J1_1: D1.2 J1.1 R3.1 R4.2
J7_1: D7.2 J7.1 R15.1 R16.2
J8_1: D8.2 J8.1 R17.1 R18.2
J9_1: D9.2 J9.1 R19.1 R20.2
J10_1: D10.2 J10.1 R21.1 R22.2
J11_1: D11.2 J11.1 R23.1 R24.2
J13_1: D13.2 J13.1 R30.2 R31.1
KEY0: C4.2 R3.2 U1.13
KEY1: C5.2 R6.2 U1.14
KEY2: C6.2 R8.2 U1.15
KEY3: C7.2 R10.2 U1.16
KEY4: C8.2 R12.2 U1.17
KEY5: C9.2 R14.2 U1.19
KEY6: C10.2 R15.2 U1.6
KEY7: C11.2 R17.2 U1.5
KEY8: C12.2 R19.2 U1.4
KEY9: C13.2 R21.2 U1.3
KEY10: C14.2 R23.2 U1.2
KEY11: C15.2 R26.2 U1.1
KEY12: C17.2 R31.2 U1.20
LED: LED2.2 U1.9
LED2_1: LED2.1 R27.1
R1_2: C16.1 R1.2 R2.2
R6_1: D2.2 J2.1 R5.2 R6.1
R8_1: D3.2 J3.1 R7.2 R8.1
R10_1: D4.2 J4.1 R9.2 R10.1
R12_1: D5.2 J5.1 R11.2 R12.1
R14_1: D6.2 J6.1 R13.2 R14.1
R26_1: D12.2 J12.1 R25.2 R26.1
R28_2: C16.2 R28.2
R32_2: R32.2 USB1.3
R33_2: R33.2 USB1.4
RXD: H2.2 U1.11
SOUND: R1.1 U1.18
TXD: H2.3 U1.12
U2_4: R28.1 R29.2 U2.4
WAVE: D1.1 D2.1 D3.1 D4.1 D5.1 D6.1 D7.1 D8.1 D9.1 D10.1 D11.1 D12.1 D13.1 R4.1 R5.1 R7.1 R9.1 R11.1 R13.1 R16.1 R18.1 R20.1 R22.1 R24.1 R25.1 R30.1 U1.7

## Via types
v1: diameter 0.61, hole 0.305, Top Layer to Bottom Layer, 47 vias

## Routing (per net, layer and track width the routed paths; a pad name or vN(x,y) marks a point on that pad's centre or on a via; arc(x,y) is an arc through that point)
GND:
  vias: v1(6.35,54.86) v1(14.61,54.74) v1(21.97,54.86) v1(29.72,54.74) v1(37.72,54.86) v1(43.69,53.34) v1(45.21,59.56) v1(51.82,54.1) v1(59.69,54.36) v1(63.75,67.69) v1(67.18,54.36) v1(70.99,64.26) v1(75.31,54.36) v1(76.07,66.93) v1(83.06,54.48) v1(86.49,60.71) v1(90.55,53.59)
VCC: length 66.1
  Top Layer w0.254: H2.1 45.34,68.71 R27.2
  Top Layer w0.4: v1(63.25,69.72) 70.49,69.72 71.12,69.09 71.12,66.8 72.26,65.66 76.58,65.66 76.96,66.04 85.4,66.04 C1.2 87.06,66.24 87.76,66.93 F1.2 ; 42.61,58.04 42.61,58.72 42.27,59.06 42.27,60.5
  Bottom Layer w0.4: v1(63.25,69.72) 61.72,68.2 45.34,68.2 ; H2.1 45.34,62.13 42.27,59.06
  vias: v1(42.26,59.06)
C3_1: length 4.3
  Top Layer w0.254: 65.53,66.1 66.74,66.1 67.18,65.66 68.41,65.66 U2.2
F1_1: length 10.4
  Top Layer w0.4: 93.4,60.2 94.75,60.2 95.12,60.58 95.12,62.74 94.62,63.24 92.21,63.24 90.81,64.64 F1.1
H1_1: length 4.8
  Top Layer w0.4: H1.1 77.34,68.2 73.82,68.2
H1_2: length 7.3
  Top Layer w0.254: R29.1 73.82,63.29 73.82,64.39
  Top Layer w0.4: H1.2 77.85,64.39 73.82,64.39
J1_1: length 40.5
  Top Layer w0.254: v1(91.31,46.36) 91.31,47.45 D1.2 92.21,48.45 92.21,51.39
  Bottom Layer w0.254: v1(91.31,46.36) 91.31,23.37 90.42,22.48 J1.1
J7_1: length 17.9
  Top Layer w0.254: v1(44.35,46.36) D7.2 45.31,48.45 45.31,51.39
  Bottom Layer w0.254: J7.1 43.31,45.32 v1(44.35,46.36)
J8_1: length 40.1
  Top Layer w0.254: v1(36.52,46.36) 36.52,47.47 D8.2 37.5,48.45 37.5,51.39
  Bottom Layer w0.254: J8.1 36.49,46.33 v1(36.52,46.36)
J9_1: length 18
  Top Layer w0.254: 29.68,51.39 29.68,48.45 28.74,47.5 28.69,47.45 v1(28.69,46.36)
  Bottom Layer w0.254: J9.1 29.84,45.2 v1(28.69,46.36)
J10_1: length 41
  Top Layer w0.254: v1(20.86,46.36) 20.86,47.44 20.92,47.5 21.86,48.45 21.86,51.39
  Bottom Layer w0.254: J10.1 23.01,44.21 v1(20.86,46.36)
J11_1: length 18.8
  Top Layer w0.254: v1(13.04,46.36) 13.04,47.43 D11.2 14.05,48.45 14.05,51.39
  Bottom Layer w0.254: v1(13.04,46.36) 16.13,43.26 J11.1
J13_1: length 13.7
  Top Layer w0.254: v1(17.14,66.55) 18.37,66.55 18.42,66.6 19.36,65.65 22.61,65.65
  Bottom Layer w0.254: J13.1 15.6,65 v1(17.14,66.55)
KEY0: length 60
  Top Layer w0.254: 93.72,51.39 93.67,51.44 C4.2 93.67,54.54 93.09,55.12 86.36,55.12 83.06,58.42 54.99,58.42 48.51,64.9 42.54,64.9 42.27,65.18 42.27,66.24
KEY1: length 53
  Top Layer w0.254: 85.9,51.39 85.85,51.44 85.85,54.61 82.68,57.78 54.74,57.78 48.13,64.39 42.29,64.39 41.62,65.06 41.62,66.24
KEY2: length 45.8
  Top Layer w0.254: U1.15 40.97,64.95 42.04,63.88 47.75,63.88 54.48,57.15 75.31,57.15 78.04,54.42 C6.2 78.04,51.44 78.08,51.39
KEY3: length 38.7
  Top Layer w0.254: U1.16 40.31,64.84 41.78,63.37 47.5,63.37 54.36,56.52 68.2,56.52 70.22,54.49 70.22,51.44 70.27,51.39
KEY4: length 31.6
  Top Layer w0.254: 62.45,51.39 62.41,51.44 62.41,54.43 60.96,55.88 54.1,55.88 47.12,62.86 41.53,62.86 39.66,64.73 U1.17
KEY5: length 24.9
  Top Layer w0.254: U1.19 38.36,65.14 41.15,62.36 46.74,62.36 54.59,54.5 C9.2 54.59,51.44 54.64,51.39
KEY6: length 14.4
  Top Layer w0.254: 40.97,60.5 40.97,55.05 41.4,54.61 46.23,54.61 46.77,54.06 C10.2 46.77,51.44 46.82,51.39
KEY7: length 9.7
  Top Layer w0.254: 40.31,60.5 40.31,54.57 C11.2 38.96,51.44 39,51.39
KEY8: length 14.4
  Top Layer w0.254: 31.19,51.39 31.14,51.44 31.14,53.21 33.3,55.37 36.32,55.37 39.66,58.71 39.66,60.5
KEY9: length 21.4
  Top Layer w0.254: 23.37,51.39 23.33,51.44 C13.2 26.12,56.01 35.94,56.01 39.01,59.08 39.01,60.5
KEY10: length 28.4
  Top Layer w0.254: 15.56,51.39 15.51,51.44 C14.2 18.94,56.64 35.69,56.64 38.36,59.32 38.36,60.5
KEY11: length 35.3
  Top Layer w0.254: 37.71,60.5 37.71,59.81 35.18,57.28 15.37,57.28 11.3,53.21 7.69,53.21 7.69,51.44 7.74,51.39
KEY12: length 16.4
  Top Layer w0.254: U1.20 37.71,65.53 36.38,64.2 C17.2 22.66,64.2 22.61,64.14
LED: length 19.4
  Top Layer w0.254: 42.92,60.5 v1(42.93,61.72)
  Bottom Layer w0.254: v1(42.93,61.72) 44.07,62.86 44.07,70.99 44.58,71.5 50.67,71.5 51.05,71.12 51.05,70
LED2_1: length 2.8
  Top Layer w0.254: v1(48.01,68.96) 48.01,67.57 R27.1
  Bottom Layer w0.254: v1(48.01,68.96) 48.01,69.06 48.95,70
R1_2: length 4.2
  Top Layer w0.254: 63.43,62.1 63.5,62.17 63.5,64.4 61.59,64.4
R6_1: length 17.6
  Top Layer w0.254: 84.39,51.39 84.39,48.45 83.45,47.5 83.48,47.46 v1(83.48,46.36)
  Bottom Layer w0.254: v1(83.48,46.36) 83.82,46.02 J2.1
R8_1: length 40.6
  Top Layer w0.254: 75.66,46.36 75.66,47.47 D3.2 76.58,48.45 76.58,51.39
  Bottom Layer w0.254: 75.66,46.36 76.94,45.07 76.94,11.68
  vias: v1(75.66,46.36)
R10_1: length 18.4
  Top Layer w0.254: 68.76,51.39 68.76,48.45 D4.2 v1(67.83,46.36)
  Bottom Layer w0.254: v1(67.83,46.36) 70.1,44.08 J4.1
R12_1: length 41.5
  Top Layer w0.254: v1(60,46.36) D5.2 60.94,48.45 60.94,51.39
  Bottom Layer w0.254: 63.46,11.68 63.46,21.51 60,24.96 v1(60,46.36)
R14_1: length 41
  Top Layer w0.254: 53.13,51.39 53.13,48.45 D6.2 v1(52.17,46.36)
  Bottom Layer w0.254: v1(52.17,46.36) 52.17,24.36 49.97,22.16 J6.1
R26_1: length 41.9
  Top Layer w0.254: 6.23,51.39 6.23,48.45 5.29,47.5 5.21,47.42 v1(5.21,46.36)
  Bottom Layer w0.254: J12.1 9.53,20.32 5.21,24.64 v1(5.21,46.36)
R28_2: length 2.1
  Top Layer w0.254: 64.84,62.1 66.94,62.1
R32_2: length 3.4
  Top Layer w0.254: 90.29,60.45 91.31,60.45 92.08,61.22 93.4,61.22
R33_2: length 3.1
  Top Layer w0.254: 93.4,62.22 90.29,62.23
RXD: length 4.1
  Top Layer w0.254: 43.57,66.24 43.57,67.69 42.8,68.45 H2.2
SOUND: length 30.6
  Top Layer w0.254: 39.01,66.24 39.01,71.15 40.13,72.26 55.24,72.26 61.59,65.91
TXD: length 4.8
  Top Layer w0.254: H2.3 42.92,67.32 U1.12
U2_4: length 5
  Top Layer w0.254: R29.2 68.45,62.1 68.41,62.13 U2.4
WAVE: length 155.6
  Top Layer w0.254: 15.56,49.61 15.56,48.45 D11.1 ; 18.42,63.2 19.36,64.14 20.7,64.14 20.7,62.99 21.84,61.85 41.28,61.85 41.62,61.51 41.62,55.41 v1(41.66,55.37) ; 23.37,49.61 23.37,48.45 D10.1 ; 7.74,49.61 7.74,48.45 D12.1 ; 70.27,49.61 70.27,48.45 71.22,47.5 ; 55.58,47.5 54.64,48.45 54.64,49.61 ; D1.1 93.72,48.45 93.72,49.61 ; 31.19,49.61 31.19,48.45 D9.1 ; 39,49.61 39,48.45 39.95,47.5 ; 78.08,49.61 78.08,48.45 D3.1 ; 46.82,49.61 46.82,48.45 47.77,47.5 ; 63.4,47.5 62.45,48.45 62.45,49.61 ; 85.9,49.61 85.9,48.45 D2.1
  Bottom Layer w0.254: v1(39,48.44) 39,52.72 v1(41.66,55.37) ; v1(93.72,48.44) v1(7.74,48.44)
  vias: v1(15.55,48.44) v1(23.37,48.44) v1(31.19,48.44) v1(46.82,48.44) v1(54.64,48.44) v1(62.45,48.58) v1(70.27,48.44) v1(78.09,48.44) v1(85.9,48.44)

## Copper pours and planes (outline as drawn; the poured copper is in the pictures)
GND on Top Layer: -2.54,52.7 101.73,52.7 101.73,74.42 101.09,75.06 24.38,75.06 24.26,75.18 24.26,60.83 21.84,58.42 15.24,58.42 12.7,55.88 -2.29,55.88 -2.54,55.63
GND on Bottom Layer: -0.89,52.7 100.33,52.7 100.33,73.79 97.92,76.2 25.4,76.2 24.26,75.06 24.26,60.83 21.84,58.42 16.64,58.42 14.1,55.88 -0.89,55.88

Small or netless copper shapes (teardrops, artwork), in the pictures only: 233 on Top Layer, 57 on Bottom Layer

# Board PCB_ePiano_2023-12-26 (1)
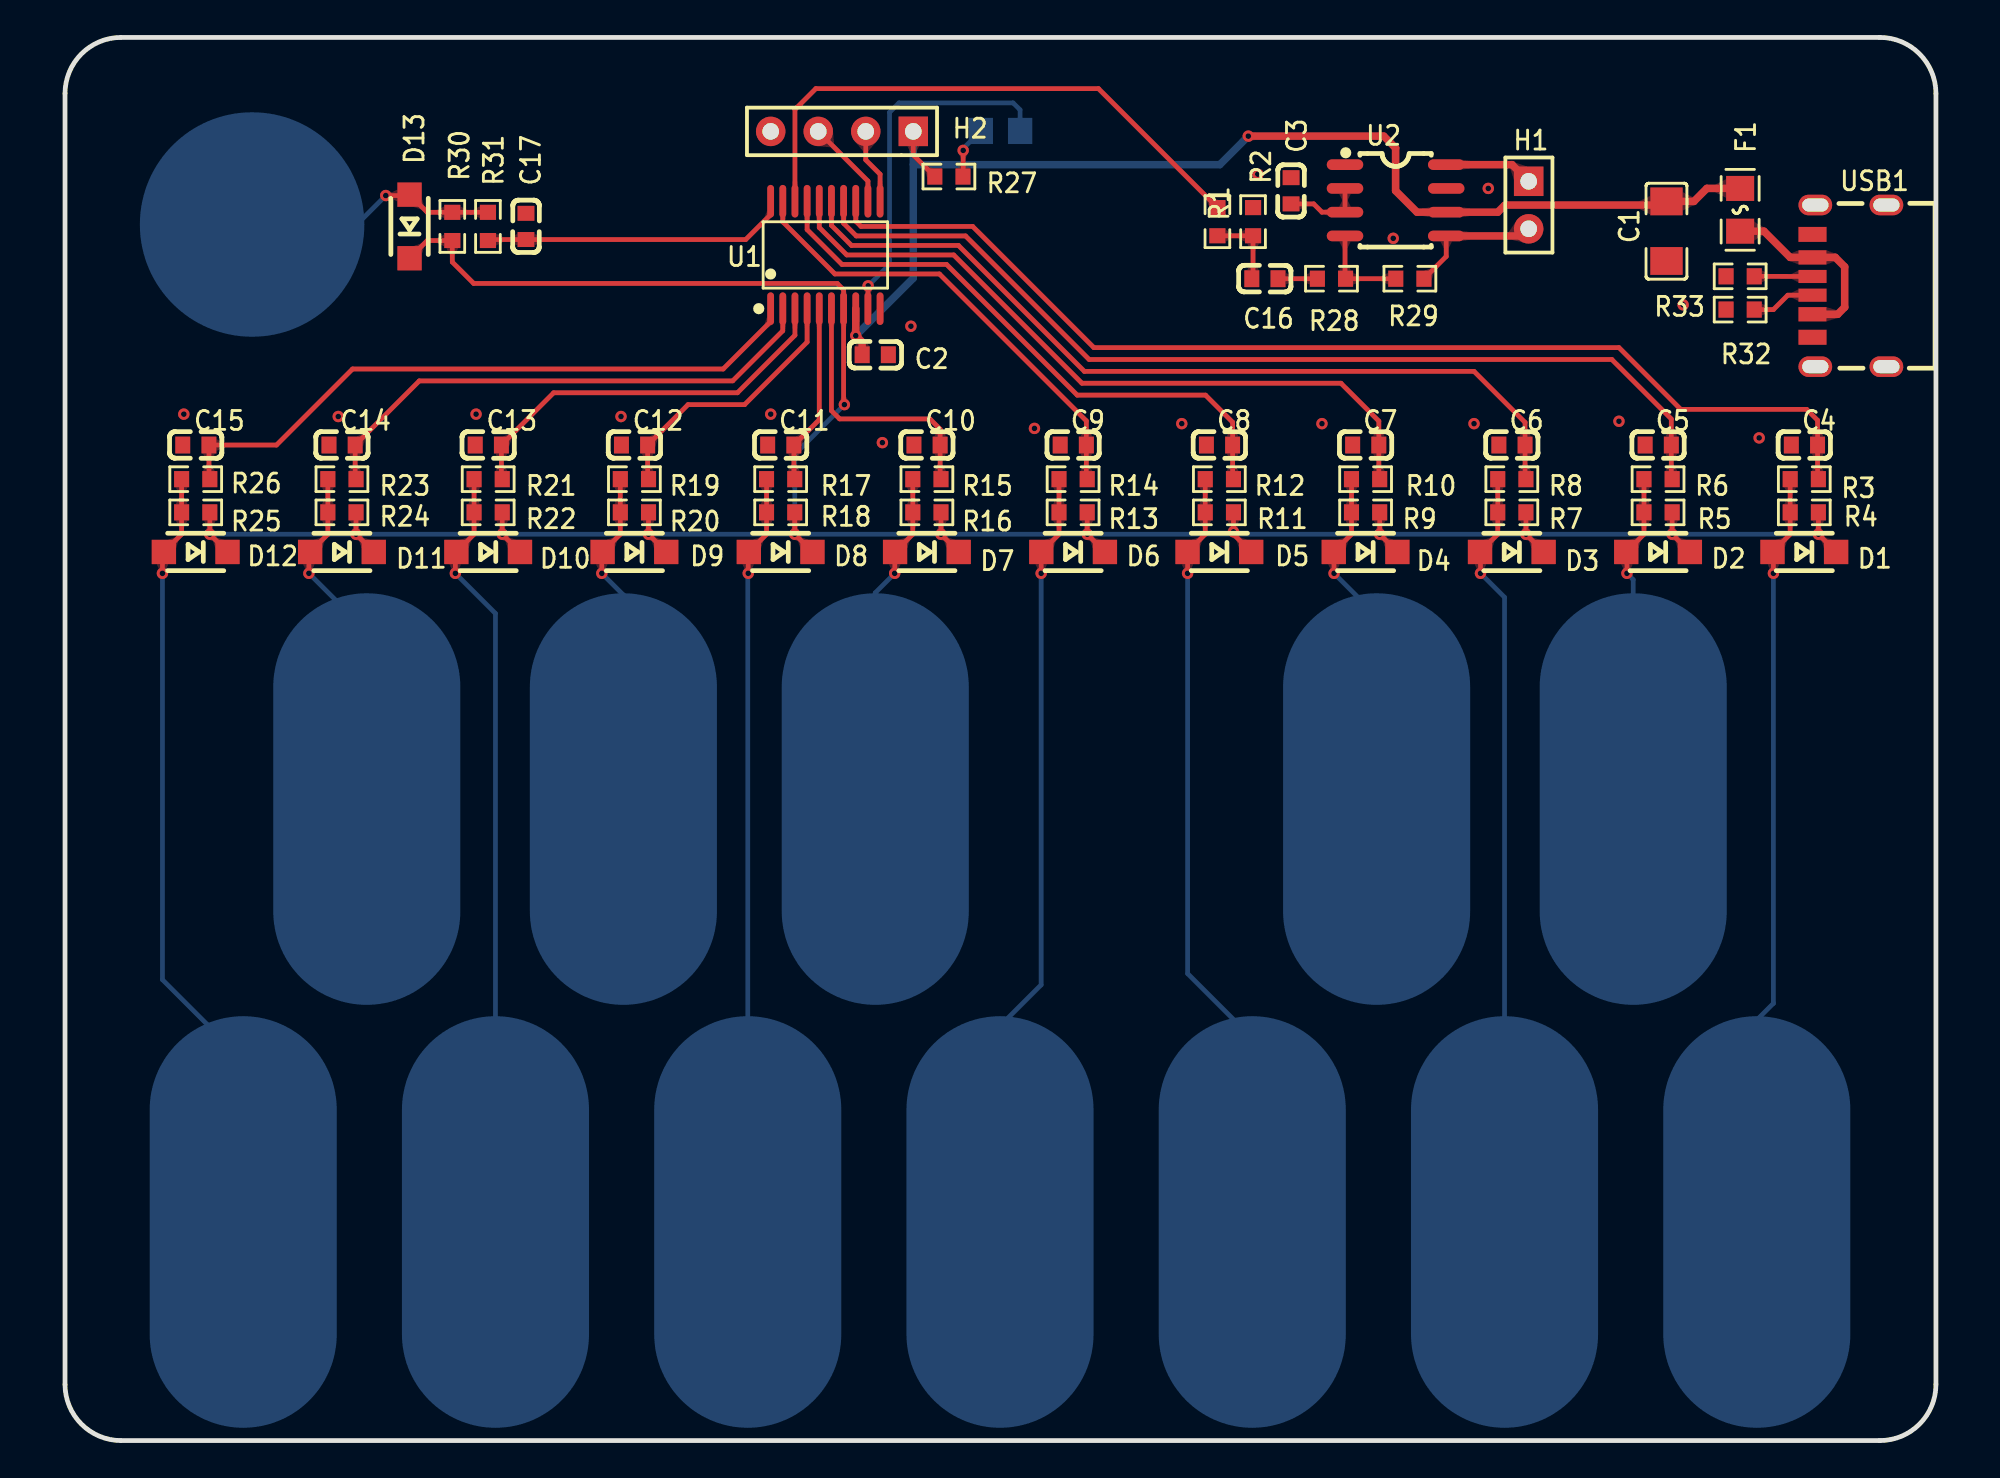
[diagram p5: board, top side]
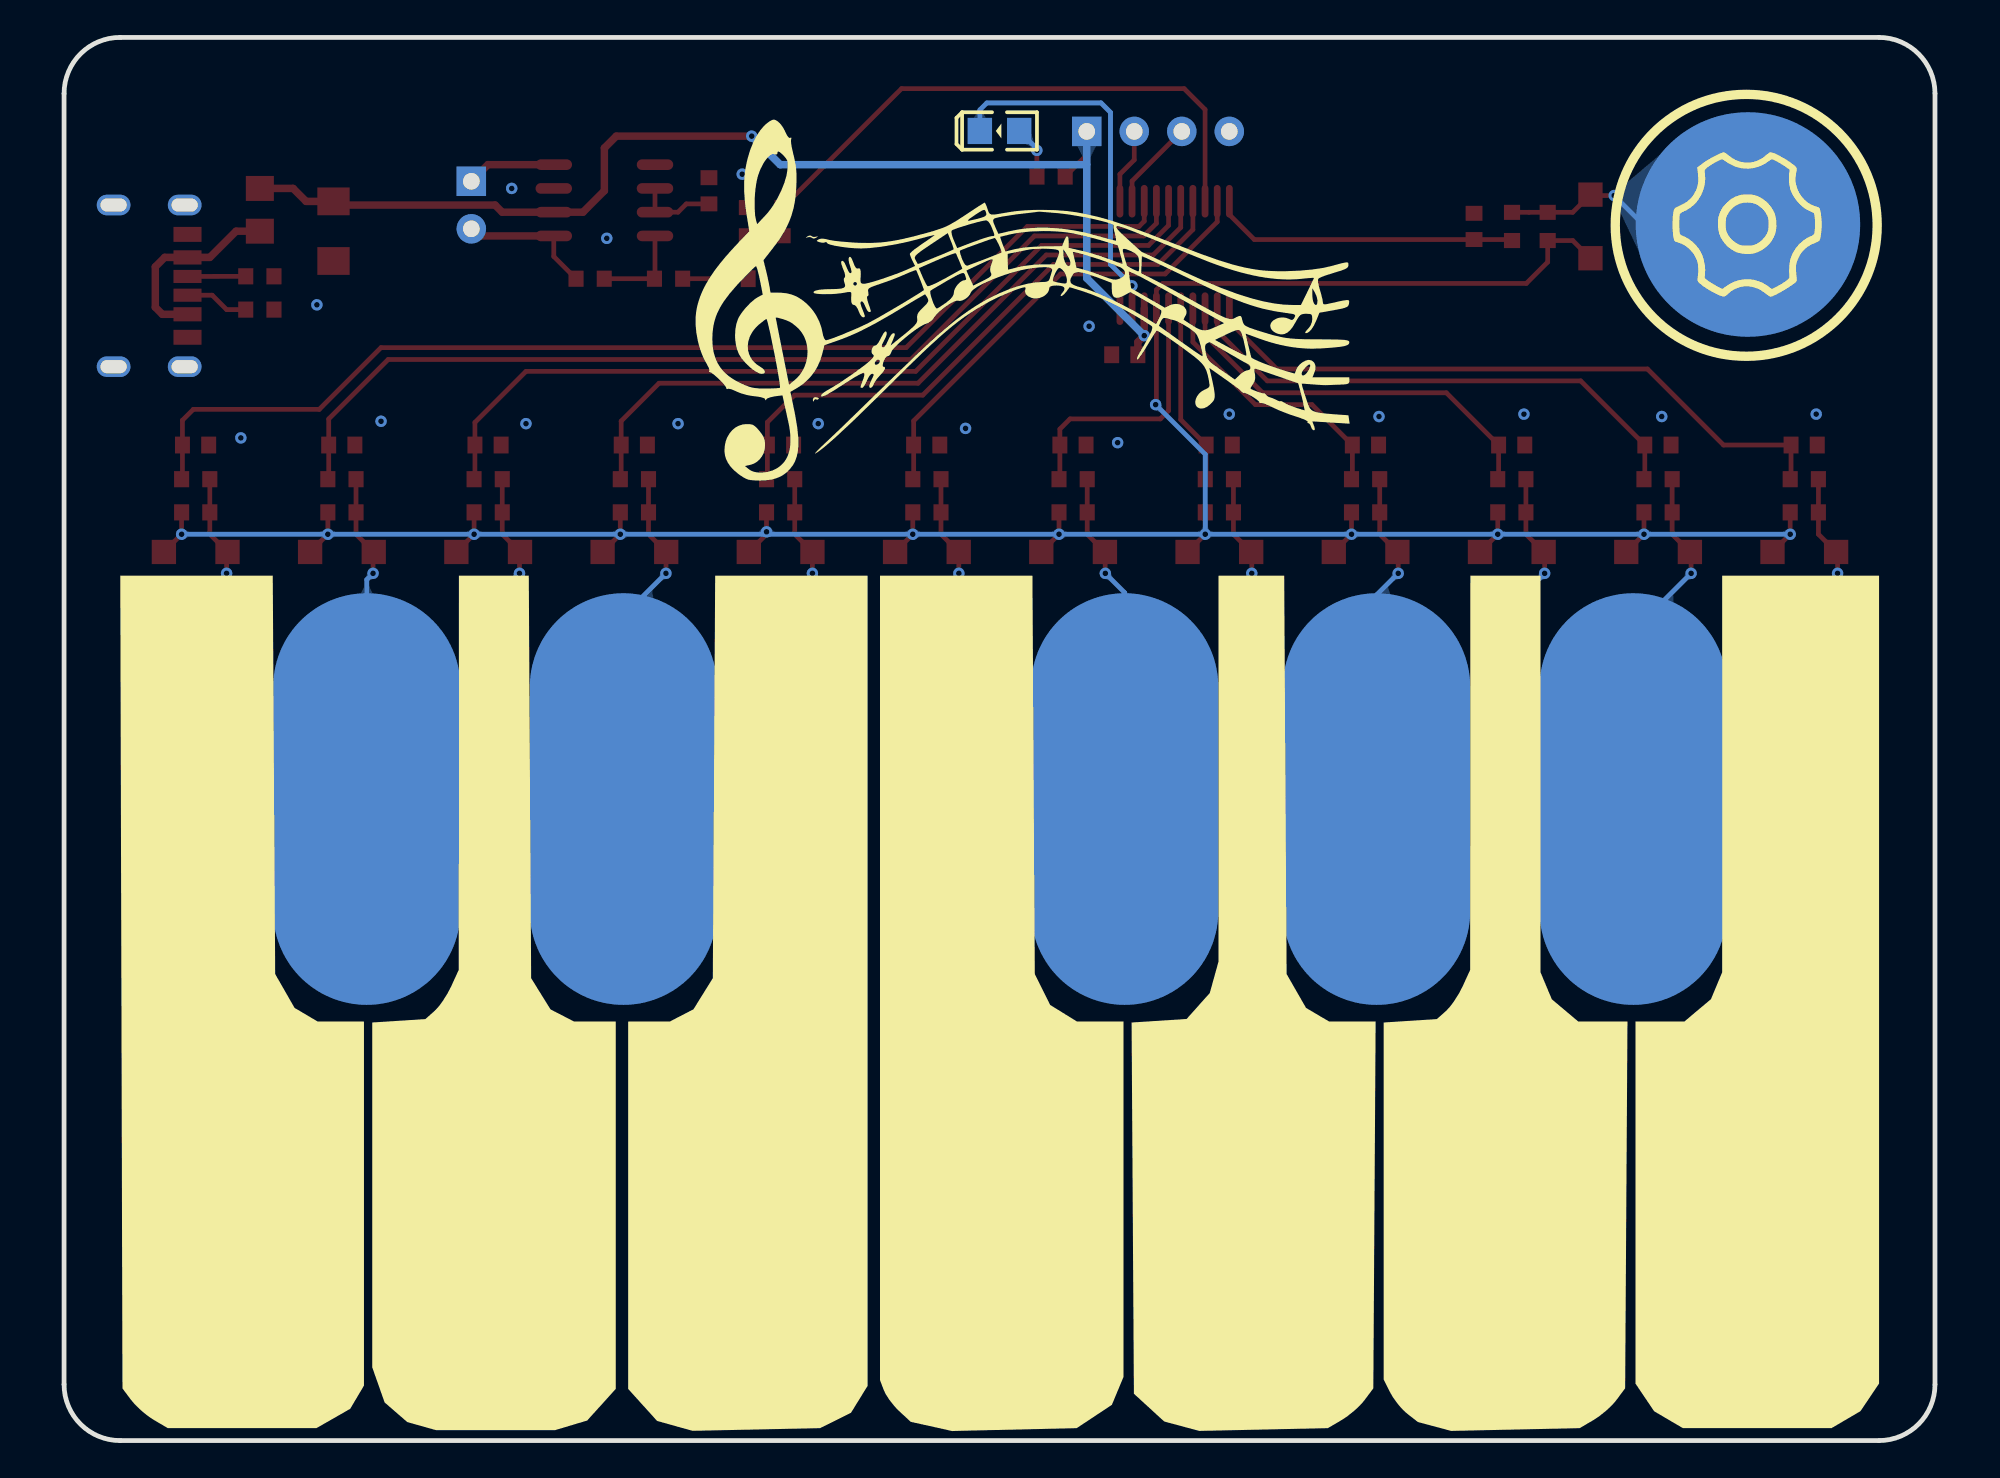
[diagram p6: board, bottom side, seen from below]

Outline 100 x 75 mm; copper layers: Top Layer, Bottom Layer. Coordinates in mm from the lower left corner of the outline.
Outline path: 0,72 arc(0.88,74.12) 3,75 97,75 arc(99.12,74.12) 100,72 100,3 arc(99.12,0.88) 97,0 3,0 arc(0.88,0.88) 0,3 0,72
Stack: Top Layer 0.035mm / Dielectric1 1.51mm FR4 er 4.5 / Bottom Layer 0.035mm

## Design rules (mm)
spacing Default (default): track to track 0.152, other pairs 0 to 0.152
track width Default (default): min 0.254, default 0.254, max 25.4
differential pair differentialPair (default): width min 0.127, default 0.254, max 2.54; gap min 0.152, default 0.152
via Default (default): diameter min 0.61, default 0.61, max 100.025; hole min 0.305, default 0.305, max 59.995
net GND uses gge10476
pour e103 uses gge10596
pour e587 uses gge10476

## Placement (name value [footprint] x y rotation side)
C1  10u  [C1206]  85.6 64.64 90 top
C2  0.1u  [C0603]  43.31 58.04 180 top
C3  1u  [C0603]  65.53 66.8 90 top
C4  10nF  [C0603]  92.97 53.21 0 top
C5  10nF  [C0603]  85.16 53.21 0 top
C6  10nF  [C0603]  77.34 53.21 0 top
C7  10nF  [C0603]  69.52 53.21 0 top
C8  10nF  [C0603]  61.71 53.21 0 top
C9  10nF  [C0603]  53.89 53.21 0 top
C10  10nF  [C0603]  46.07 53.21 0 top
C11  10nF  [C0603]  38.26 53.21 0 top
C12  10nF  [C0603]  30.44 53.21 0 top
C13  10nF  [C0603]  22.62 53.21 0 top
C14  10nF  [C0603]  14.81 53.21 0 top
C15  10nF  [C0603]  6.99 53.21 0 top
C16  0.39u  [C0603]  64.13 62.1 0 top
C17  10nF  [C0603]  24.64 64.9 270 top
D1  1N4148W  [SOD-123FL_L2.6-W1.6-LS3.4-RD]  92.96 47.5 0 top
D2  1N4148W  [SOD-123FL_L2.6-W1.6-LS3.4-RD]  85.15 47.5 0 top
D3  1N4148W  [SOD-123FL_L2.6-W1.6-LS3.4-RD]  77.33 47.5 0 top
D4  1N4148W  [SOD-123FL_L2.6-W1.6-LS3.4-RD]  69.51 47.5 0 top
D5  1N4148W  [SOD-123FL_L2.6-W1.6-LS3.4-RD]  61.7 47.5 0 top
D6  1N4148W  [SOD-123FL_L2.6-W1.6-LS3.4-RD]  53.88 47.5 0 top
D7  1N4148W  [SOD-123FL_L2.6-W1.6-LS3.4-RD]  46.07 47.5 0 top
D8  1N4148W  [SOD-123FL_L2.6-W1.6-LS3.4-RD]  38.25 47.5 0 top
D9  1N4148W  [SOD-123FL_L2.6-W1.6-LS3.4-RD]  30.43 47.5 0 top
D10  1N4148W  [SOD-123FL_L2.6-W1.6-LS3.4-RD]  22.62 47.5 0 top
D11  1N4148W  [SOD-123FL_L2.6-W1.6-LS3.4-RD]  14.8 47.5 0 top
D12  1N4148W  [SOD-123FL_L2.6-W1.6-LS3.4-RD]  6.98 47.5 0 top
D13  1N4148W  [SOD-123FL_L2.6-W1.6-LS3.4-RD]  18.42 64.9 270 top
F1  ASMD0805-050  [F0805]  89.53 65.79 90 top
H1  HDR-F-2.54_1x2  [HDR-F-2.54_1X2]  78.23 66.04 270 top
H2  HDR-F-2.54_1x4  [HDR-F-2.54_1X4]  41.53 69.98 180 top
J1  HDR-M-2.54_1x1  [TOUCH_PAD]  90.42 11.68 180 bottom
J2  HDR-M-2.54_1x1  [TOUCH_PAD]  83.82 34.29 180 bottom
J3  HDR-M-2.54_1x1  [TOUCH_PAD]  76.94 11.68 180 bottom
J4  HDR-M-2.54_1x1  [TOUCH_PAD]  70.1 34.29 180 bottom
J5  HDR-M-2.54_1x1  [TOUCH_PAD]  63.46 11.68 180 bottom
J6  HDR-M-2.54_1x1  [TOUCH_PAD]  49.97 11.68 180 bottom
J7  HDR-M-2.54_1x1  [TOUCH_PAD]  43.31 34.29 180 bottom
J8  HDR-M-2.54_1x1  [TOUCH_PAD]  36.49 11.68 180 bottom
J9  HDR-M-2.54_1x1  [TOUCH_PAD]  29.84 34.29 180 bottom
J10  HDR-M-2.54_1x1  [TOUCH_PAD]  23.01 11.68 180 bottom
J11  HDR-M-2.54_1x1  [TOUCH_PAD]  16.13 34.29 180 bottom
J12  HDR-M-2.54_1x1  [TOUCH_PAD]  9.53 11.68 180 bottom
J13  HDR-M-2.54_1x1  [TOUCH_PAD#2]  10 65 180 bottom
LED2  LED-0805_R  [LED0805_RED]  50 70 0 bottom
R1  1k  [R0603]  61.59 65.15 270 top
R2  1k  [R0603]  63.5 65.15 270 top
R3  1M  [R0603]  92.96 51.39 0 top
R4  1M  [R0603]  92.96 49.61 180 top
R5  1M  [R0603]  85.15 49.61 180 top
R6  1M  [R0603]  85.15 51.39 0 top
R7  1M  [R0603]  77.33 49.61 180 top
R8  1M  [R0603]  77.33 51.39 0 top
R9  1M  [R0603]  69.51 49.61 180 top
R10  1M  [R0603]  69.51 51.39 0 top
R11  1M  [R0603]  61.7 49.61 180 top
R12  1M  [R0603]  61.7 51.39 0 top
R13  1M  [R0603]  53.88 49.61 180 top
R14  1M  [R0603]  53.88 51.39 0 top
R15  1M  [R0603]  46.07 51.39 0 top
R16  1M  [R0603]  46.07 49.61 180 top
R17  1M  [R0603]  38.25 51.39 0 top
R18  1M  [R0603]  38.25 49.61 180 top
R19  1M  [R0603]  30.43 51.39 0 top
R20  1M  [R0603]  30.43 49.61 180 top
R21  1M  [R0603]  22.62 51.39 0 top
R22  1M  [R0603]  22.62 49.61 180 top
R23  1M  [R0603]  14.8 51.39 0 top
R24  1M  [R0603]  14.8 49.61 180 top
R25  1M  [R0603]  6.98 49.61 180 top
R26  1M  [R0603]  6.98 51.39 0 top
R27  1K  [R0603]  47.24 67.56 180 top
R28  20k  [R0603]  67.69 62.1 180 top
R29  20k  [R0603]  71.88 62.1 180 top
R30  1M  [R0603]  20.7 64.9 90 top
R31  1M  [R0603]  22.61 64.9 270 top
R32  5.1k  [R0603]  89.53 60.45 0 top
R33  5.1k  [R0603]  89.53 62.23 0 top
U1  STC8G1K17-38I-TSSOP20  [TSSOP-20_L6.5-W4.4-P0.65-LS6.4-BL]  40.64 63.37 0 top
U2  TC8002D  [SOIC-8_L5.0-W4.0-P1.27-LS6.0-BL]  71.12 66.29 270 top
USB1  TYPE-C-31-M-17  [USB-C-SMD_10P-P1.00-L6.8-W8.9]  95.38 61.72 90 top

## Footprints (pads in the part's own frame, mm; a bottom-side part is the same pattern mirrored in y, then rotated)
C0603
  rect 0.8x0.9 smd: 1(-0.7,0) 2(0.7,0)
C1206
  rect 1.485x1.728 smd: 1(-1.593,0) 2(1.593,0)
F0805
  rect 1.335x1.5 smd: 1(-1.143,0) 2(1.143,0)
HDR-F-2.54_1X2
  rect 1.575x1.575 hole 0.889: 1(-1.27,0)
  round 1.575 hole 0.889: 2(1.27,0)
HDR-F-2.54_1X4
  rect 1.575x1.575 hole 0.889: 1(-3.81,0)
  round 1.575 hole 0.889: 2(-1.27,0) 3(1.27,0) 4(3.81,0)
LED0805_RED
  rect 1.3x1.399 smd: 1(-1.05,0) 2(1.05,0)
R0603
  rect 0.806x0.864 smd: 1(-0.753,0) 2(0.753,0)
SOD-123FL_L2.6-W1.6-LS3.4-RD
  rect 1.3x1.3 smd: 1(1.7,0) 2(-1.7,0)
SOIC-8_L5.0-W4.0-P1.27-LS6.0-BL
  oval 0.569x1.95 smd: 1(-1.905,-2.705) 2(-0.635,-2.705) 3(0.635,-2.705) 4(1.905,-2.705) 5(1.905,2.705) 6(0.635,2.705) 7(-0.635,2.705) 8(-1.905,2.705)
TOUCH_PAD
  oval 10x22 smd: 1(0,0)
TOUCH_PAD#2
  round 12 smd: 1(0,0)
TSSOP-20_L6.5-W4.4-P0.65-LS6.4-BL
  oval 0.364x1.742 smd: 1(-2.925,-2.871) 2(-2.275,-2.871) 3(-1.625,-2.871) 4(-0.975,-2.871) 5(-0.325,-2.871) 6(0.325,-2.871) 7(0.975,-2.871) 8(1.625,-2.871) 9(2.275,-2.871) 10(2.925,-2.871) 11(2.925,2.871) 12(2.275,2.871) 13(1.625,2.871) 14(0.975,2.871) 15(0.325,2.871) 16(-0.325,2.871) 17(-0.975,2.871) 18(-1.625,2.871) 19(-2.275,2.871) 20(-2.925,2.871)
USB-C-SMD_10P-P1.00-L6.8-W8.9
  oval 1.1x1.8 hole 0.7x1.401: 0(4.32,1.825) 7(-4.32,1.825) 8(4.32,-1.975) 9(-4.32,-1.975)
  rect 0.8x1.5 smd: 1(-2.749,1.975) 6(2.749,1.975)
  rect 0.76x1.5 smd: 2(-1.52,1.975) 5(1.52,1.975)
  rect 0.7x1.5 smd: 3(-0.5,1.975) 4(0.5,1.975)

## Nets
GND: C1.1 C2.1 C3.2 C4.1 C5.1 C6.1 C7.1 C8.1 C9.1 C10.1 C11.1 C12.1 C13.1 C14.1 C15.1 C17.1 H2.4 R2.1 R32.1 R33.1 U1.10 U2.1 U2.7 USB1.0 USB1.1 USB1.6 USB1.7 USB1.8 USB1.9
VCC: C1.2 C2.2 F1.2 H2.1 R27.2 U1.8 U2.6
C3_1: C3.1 U2.2 U2.3
F1_1: F1.1 USB1.2 USB1.5
H1_1: H1.1 U2.8
H1_2: H1.2 R29.1 U2.5
J1_1: D1.2 J1.1 R3.1 R4.2
J7_1: D7.2 J7.1 R15.1 R16.2
J8_1: D8.2 J8.1 R17.1 R18.2
J9_1: D9.2 J9.1 R19.1 R20.2
J10_1: D10.2 J10.1 R21.1 R22.2
J11_1: D11.2 J11.1 R23.1 R24.2
J13_1: D13.2 J13.1 R30.2 R31.1
KEY0: C4.2 R3.2 U1.13
KEY1: C5.2 R6.2 U1.14
KEY2: C6.2 R8.2 U1.15
KEY3: C7.2 R10.2 U1.16
KEY4: C8.2 R12.2 U1.17
KEY5: C9.2 R14.2 U1.19
KEY6: C10.2 R15.2 U1.6
KEY7: C11.2 R17.2 U1.5
KEY8: C12.2 R19.2 U1.4
KEY9: C13.2 R21.2 U1.3
KEY10: C14.2 R23.2 U1.2
KEY11: C15.2 R26.2 U1.1
KEY12: C17.2 R31.2 U1.20
LED: LED2.2 U1.9
LED2_1: LED2.1 R27.1
R1_2: C16.1 R1.2 R2.2
R6_1: D2.2 J2.1 R5.2 R6.1
R8_1: D3.2 J3.1 R7.2 R8.1
R10_1: D4.2 J4.1 R9.2 R10.1
R12_1: D5.2 J5.1 R11.2 R12.1
R14_1: D6.2 J6.1 R13.2 R14.1
R26_1: D12.2 J12.1 R25.2 R26.1
R28_2: C16.2 R28.2
R32_2: R32.2 USB1.3
R33_2: R33.2 USB1.4
RXD: H2.2 U1.11
SOUND: R1.1 U1.18
TXD: H2.3 U1.12
U2_4: R28.1 R29.2 U2.4
WAVE: D1.1 D2.1 D3.1 D4.1 D5.1 D6.1 D7.1 D8.1 D9.1 D10.1 D11.1 D12.1 D13.1 R4.1 R5.1 R7.1 R9.1 R11.1 R13.1 R16.1 R18.1 R20.1 R22.1 R24.1 R25.1 R30.1 U1.7

## Via types
v1: diameter 0.61, hole 0.305, Top Layer to Bottom Layer, 47 vias

## Routing (per net, layer and track width the routed paths; a pad name or vN(x,y) marks a point on that pad's centre or on a via; arc(x,y) is an arc through that point)
GND:
  vias: v1(6.35,54.86) v1(14.61,54.74) v1(21.97,54.86) v1(29.72,54.74) v1(37.72,54.86) v1(43.69,53.34) v1(45.21,59.56) v1(51.82,54.1) v1(59.69,54.36) v1(63.75,67.69) v1(67.18,54.36) v1(70.99,64.26) v1(75.31,54.36) v1(76.07,66.93) v1(83.06,54.48) v1(86.49,60.71) v1(90.55,53.59)
VCC: length 66.1
  Top Layer w0.254: H2.1 45.34,68.71 R27.2
  Top Layer w0.4: F1.2 87.76,66.93 87.06,66.24 C1.2 85.4,66.04 76.96,66.04 76.58,65.66 72.26,65.66 71.12,66.8 71.12,69.09 70.49,69.72 v1(63.25,69.72) ; 42.61,58.04 42.61,58.72 42.27,59.06 42.27,60.5
  Bottom Layer w0.4: 42.27,59.06 45.34,62.13 H2.1 ; 45.34,68.2 61.72,68.2 v1(63.25,69.72)
  vias: v1(42.26,59.06)
C3_1: length 4.3
  Top Layer w0.254: 65.53,66.1 66.74,66.1 67.18,65.66 68.41,65.66 U2.2
F1_1: length 10.4
  Top Layer w0.4: F1.1 90.81,64.64 92.21,63.24 94.62,63.24 95.12,62.74 95.12,60.58 94.75,60.2 93.4,60.2
H1_1: length 4.8
  Top Layer w0.4: 73.82,68.2 77.34,68.2 H1.1
H1_2: length 7.3
  Top Layer w0.254: R29.1 73.82,63.29 73.82,64.39
  Top Layer w0.4: H1.2 77.85,64.39 73.82,64.39
J1_1: length 40.5
  Top Layer w0.254: 92.21,51.39 92.21,48.45 D1.2 91.31,47.45 v1(91.31,46.36)
  Bottom Layer w0.254: v1(91.31,46.36) 91.31,23.37 90.42,22.48 J1.1
J7_1: length 17.9
  Top Layer w0.254: 45.31,51.39 45.31,48.45 D7.2 v1(44.35,46.36)
  Bottom Layer w0.254: J7.1 43.31,45.32 v1(44.35,46.36)
J8_1: length 40.1
  Top Layer w0.254: v1(36.52,46.36) 36.52,47.47 D8.2 37.5,48.45 37.5,51.39
  Bottom Layer w0.254: v1(36.52,46.36) 36.49,46.33 J8.1
J9_1: length 18
  Top Layer w0.254: v1(28.69,46.36) 28.69,47.45 28.74,47.5 29.68,48.45 29.68,51.39
  Bottom Layer w0.254: v1(28.69,46.36) 29.84,45.2 J9.1
J10_1: length 41
  Top Layer w0.254: 21.86,51.39 21.86,48.45 20.92,47.5 20.86,47.44 v1(20.86,46.36)
  Bottom Layer w0.254: v1(20.86,46.36) 23.01,44.21 J10.1
J11_1: length 18.8
  Top Layer w0.254: v1(13.04,46.36) 13.04,47.43 D11.2 14.05,48.45 14.05,51.39
  Bottom Layer w0.254: J11.1 16.13,43.26 v1(13.04,46.36)
J13_1: length 13.7
  Top Layer w0.254: 22.61,65.65 19.36,65.65 18.42,66.6 18.37,66.55 v1(17.14,66.55)
  Bottom Layer w0.254: v1(17.14,66.55) 15.6,65 J13.1
KEY0: length 60
  Top Layer w0.254: 93.72,51.39 93.67,51.44 C4.2 93.67,54.54 93.09,55.12 86.36,55.12 83.06,58.42 54.99,58.42 48.51,64.9 42.54,64.9 42.27,65.18 42.27,66.24
KEY1: length 53
  Top Layer w0.254: 41.62,66.24 41.62,65.06 42.29,64.39 48.13,64.39 54.74,57.78 82.68,57.78 85.85,54.61 85.85,51.44 85.9,51.39
KEY2: length 45.8
  Top Layer w0.254: 78.08,51.39 78.04,51.44 C6.2 78.04,54.42 75.31,57.15 54.48,57.15 47.75,63.88 42.04,63.88 40.97,64.95 U1.15
KEY3: length 38.7
  Top Layer w0.254: U1.16 40.31,64.84 41.78,63.37 47.5,63.37 54.36,56.52 68.2,56.52 70.22,54.49 70.22,51.44 70.27,51.39
KEY4: length 31.6
  Top Layer w0.254: 62.45,51.39 62.41,51.44 62.41,54.43 60.96,55.88 54.1,55.88 47.12,62.86 41.53,62.86 39.66,64.73 U1.17
KEY5: length 24.9
  Top Layer w0.254: U1.19 38.36,65.14 41.15,62.36 46.74,62.36 54.59,54.5 C9.2 54.59,51.44 54.64,51.39
KEY6: length 14.4
  Top Layer w0.254: 46.82,51.39 46.77,51.44 C10.2 46.77,54.06 46.23,54.61 41.4,54.61 40.97,55.05 40.97,60.5
KEY7: length 9.7
  Top Layer w0.254: 40.31,60.5 40.31,54.57 C11.2 38.96,51.44 39,51.39
KEY8: length 14.4
  Top Layer w0.254: 39.66,60.5 39.66,58.71 36.32,55.37 33.3,55.37 31.14,53.21 31.14,51.44 31.19,51.39
KEY9: length 21.4
  Top Layer w0.254: 23.37,51.39 23.33,51.44 C13.2 26.12,56.01 35.94,56.01 39.01,59.08 39.01,60.5
KEY10: length 28.4
  Top Layer w0.254: 38.36,60.5 38.36,59.32 35.69,56.64 18.94,56.64 C14.2 15.51,51.44 15.56,51.39
KEY11: length 35.3
  Top Layer w0.254: 37.71,60.5 37.71,59.81 35.18,57.28 15.37,57.28 11.3,53.21 7.69,53.21 7.69,51.44 7.74,51.39
KEY12: length 16.4
  Top Layer w0.254: U1.20 37.71,65.53 36.38,64.2 C17.2 22.66,64.2 22.61,64.14
LED: length 19.4
  Top Layer w0.254: 42.92,60.5 v1(42.93,61.72)
  Bottom Layer w0.254: 51.05,70 51.05,71.12 50.67,71.5 44.58,71.5 44.07,70.99 44.07,62.86 v1(42.93,61.72)
LED2_1: length 2.8
  Top Layer w0.254: R27.1 48.01,67.57 v1(48.01,68.96)
  Bottom Layer w0.254: 48.95,70 48.01,69.06 v1(48.01,68.96)
R1_2: length 4.2
  Top Layer w0.254: 63.43,62.1 63.5,62.17 63.5,64.4 61.59,64.4
R6_1: length 17.6
  Top Layer w0.254: v1(83.48,46.36) 83.48,47.46 83.45,47.5 84.39,48.45 84.39,51.39
  Bottom Layer w0.254: J2.1 83.82,46.02 v1(83.48,46.36)
R8_1: length 40.6
  Top Layer w0.254: 75.66,46.36 75.66,47.47 D3.2 76.58,48.45 76.58,51.39
  Bottom Layer w0.254: 75.66,46.36 76.94,45.07 76.94,11.68
  vias: v1(75.66,46.36)
R10_1: length 18.4
  Top Layer w0.254: v1(67.83,46.36) D4.2 68.76,48.45 68.76,51.39
  Bottom Layer w0.254: v1(67.83,46.36) 70.1,44.08 J4.1
R12_1: length 41.5
  Top Layer w0.254: v1(60,46.36) D5.2 60.94,48.45 60.94,51.39
  Bottom Layer w0.254: 63.46,11.68 63.46,21.51 60,24.96 v1(60,46.36)
R14_1: length 41
  Top Layer w0.254: 53.13,51.39 53.13,48.45 D6.2 v1(52.17,46.36)
  Bottom Layer w0.254: J6.1 49.97,22.16 52.17,24.36 v1(52.17,46.36)
R26_1: length 41.9
  Top Layer w0.254: 6.23,51.39 6.23,48.45 5.29,47.5 5.21,47.42 v1(5.21,46.36)
  Bottom Layer w0.254: v1(5.21,46.36) 5.21,24.64 9.53,20.32 J12.1
R28_2: length 2.1
  Top Layer w0.254: 64.84,62.1 66.94,62.1
R32_2: length 3.4
  Top Layer w0.254: 90.29,60.45 91.31,60.45 92.08,61.22 93.4,61.22
R33_2: length 3.1
  Top Layer w0.254: 93.4,62.22 90.29,62.23
RXD: length 4.1
  Top Layer w0.254: H2.2 42.8,68.45 43.57,67.69 43.57,66.24
SOUND: length 30.6
  Top Layer w0.254: 61.59,65.91 55.24,72.26 40.13,72.26 39.01,71.15 39.01,66.24
TXD: length 4.8
  Top Layer w0.254: H2.3 42.92,67.32 U1.12
U2_4: length 5
  Top Layer w0.254: R29.2 68.45,62.1 68.41,62.13 U2.4
WAVE: length 155.6
  Top Layer w0.254: D9.1 31.19,48.45 31.19,49.61 ; D11.1 15.56,48.45 15.56,49.61 ; v1(41.66,55.37) 41.62,55.41 41.62,61.51 41.28,61.85 21.84,61.85 20.7,62.99 20.7,64.14 19.36,64.14 18.42,63.2 ; 54.64,49.61 54.64,48.45 55.58,47.5 ; 63.4,47.5 62.45,48.45 62.45,49.61 ; D1.1 93.72,48.45 93.72,49.61 ; 46.82,49.61 46.82,48.45 47.77,47.5 ; 71.22,47.5 70.27,48.45 70.27,49.61 ; 78.08,49.61 78.08,48.45 D3.1 ; 39,49.61 39,48.45 39.95,47.5 ; 85.9,49.61 85.9,48.45 D2.1 ; 7.74,49.61 7.74,48.45 D12.1 ; 23.37,49.61 23.37,48.45 D10.1
  Bottom Layer w0.254: v1(39,48.44) 39,52.72 v1(41.66,55.37) ; v1(93.72,48.44) v1(7.74,48.44)
  vias: v1(15.55,48.44) v1(23.37,48.44) v1(31.19,48.44) v1(46.82,48.44) v1(54.64,48.44) v1(62.45,48.58) v1(70.27,48.44) v1(78.09,48.44) v1(85.9,48.44)

## Copper pours and planes (outline as drawn; the poured copper is in the pictures)
GND on Top Layer: -2.54,52.7 101.73,52.7 101.73,74.42 101.09,75.06 24.38,75.06 24.26,75.18 24.26,60.83 21.84,58.42 15.24,58.42 12.7,55.88 -2.29,55.88 -2.54,55.63
GND on Bottom Layer: -0.89,52.7 100.33,52.7 100.33,73.79 97.92,76.2 25.4,76.2 24.26,75.06 24.26,60.83 21.84,58.42 16.64,58.42 14.1,55.88 -0.89,55.88

Small or netless copper shapes (teardrops, artwork), in the pictures only: 233 on Top Layer, 57 on Bottom Layer
